# Altium project SAMC21N_Xplained_Pro.PrjPCB (part 1 of 3)
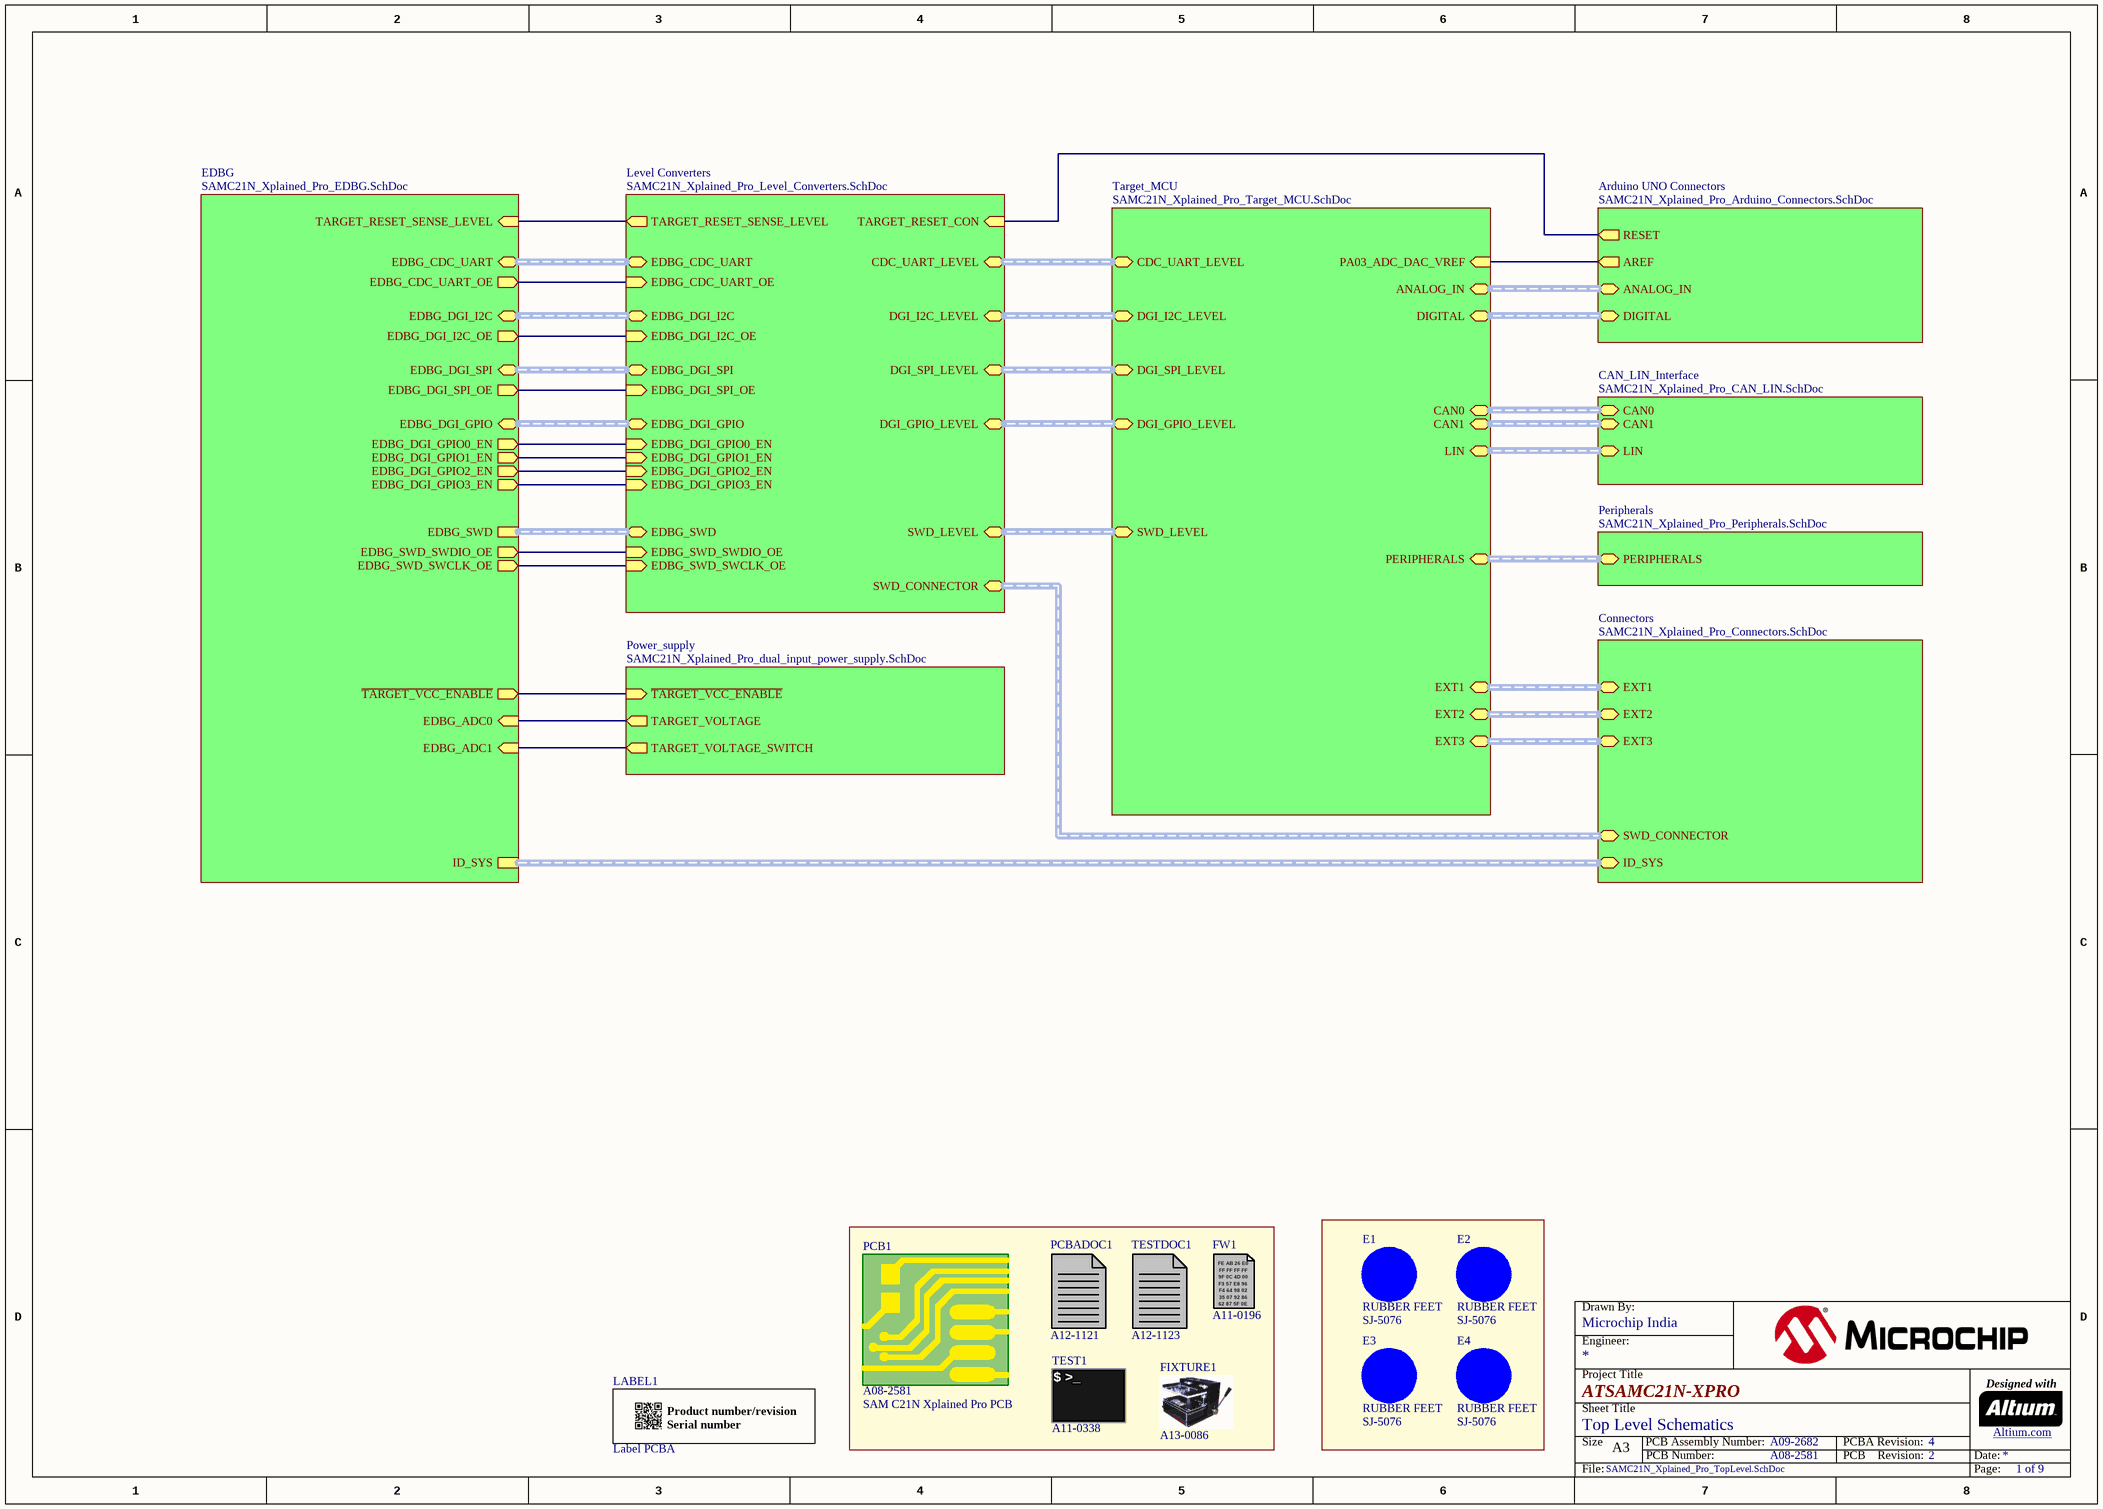
[diagram p0: SAMC21N_Xplained_Pro_TopLevel.SchDoc]
9 sheets, 256 parts. Net scope: hierarchical (ports join the sheet entries above them; power ports are global).
Board file: SAMC21N_Xplained_Pro.PcbDoc
Sheets:
  SAMC21N_Xplained_Pro_TopLevel.SchDoc
    Target_MCU = SAMC21N_Xplained_Pro_Target_MCU.SchDoc
    EDBG = SAMC21N_Xplained_Pro_EDBG.SchDoc
    Connectors = SAMC21N_Xplained_Pro_Connectors.SchDoc
    Power_supply = SAMC21N_Xplained_Pro_dual_input_power_supply.SchDoc
    CAN_LIN_Interface = SAMC21N_Xplained_Pro_CAN_LIN.SchDoc
    Arduino UNO Connectors = SAMC21N_Xplained_Pro_Arduino_Connectors.SchDoc
    Level Converters = SAMC21N_Xplained_Pro_Level_Converters.SchDoc
    Peripherals = SAMC21N_Xplained_Pro_Peripherals.SchDoc

## Sheet SAMC21N_Xplained_Pro_TopLevel.SchDoc: Top Level Schematics
size A3; Organization: Microchip India; DocumentNumber: A09-2682; Revision: 4; SheetNumber: 1; SheetTotal: 9; CheckedBy: M.S.K; DrawnBy: Microchip India; PageSetup: Record=PageOptions|CenterHorizontal=True|CenterVertical=True|PrintScale=1.01|XCorrection=1.00|YCorrection=1.00|PrintKind=1|BorderSize=5000000|LeftOffset=0|BottomOffset=0|Orientation=2|PaperLength=1000|PaperWidth=1000|Scale=100|PaperSource=7|PrintQuality=-4|MediaType=1|DitherType=10|PaperKind=Letter|PrintScaleMode=1; ProjectTitle: ATSAMC21N-XPRO; PCBNumber: A08-2581; PCBRevision: 2

### Parts
E1  RUBBER FEET  value SJ-5076  [AP8-00192]
E2  RUBBER FEET  value SJ-5076  [AP8-00192]
E3  RUBBER FEET  value SJ-5076  [AP8-00192]
E4  RUBBER FEET  value SJ-5076  [AP8-00192]
FIXTURE1  AN: A13-0086  (hidden comment: JIG)  (mechanical)
FW1  AN: A11-0196  (hidden comment: FW)  (mechanical)
LABEL1  value Label PCBA  [AP8-00317]  (hidden comment: PCBA_LABEL)
PCB1  value SAM C21N Xplained Pro PCB  AN: A08-2581  (hidden comment: PCB)  (mechanical)
PCBADOC1  AN: A12-1121  (hidden comment: PCBADOC)  (mechanical)
TEST1  AN: A11-0338  (hidden comment: TEST)  (mechanical)
TESTDOC1  AN: A12-1123  (hidden comment: TESTDOC)  (mechanical)

### Sub-sheets
Arduino UNO Connectors = SAMC21N_Xplained_Pro_Arduino_Connectors.SchDoc: ANALOG_IN (harness ANALOG_IN), DIGITAL (harness DIGITAL1), RESET (out), AREF (out)
CAN_LIN_Interface = SAMC21N_Xplained_Pro_CAN_LIN.SchDoc: CAN1 (harness CAN), LIN (harness LIN), CAN0 (harness CAN)
Connectors = SAMC21N_Xplained_Pro_Connectors.SchDoc: ID_SYS (harness ID_SYS), EXT1 (harness EXT), EXT3 (harness EXT), EXT2 (harness EXT), SWD_CONNECTOR (harness SWD)
EDBG = SAMC21N_Xplained_Pro_EDBG.SchDoc: ID_SYS (harness ID_SYS), EDBG_SWD (harness SWD), EDBG_CDC_UART (harness CDC_UART), EDBG_DGI_I2C (harness DGI_I2C), EDBG_DGI_SPI (harness DGI_SPI), EDBG_DGI_GPIO (harness DGI_GPIO), EDBG_ADC0 (in), ~{TARGET_VCC_ENABLE} (out), EDBG_CDC_UART_OE (out), EDBG_SWD_SWDIO_OE (out), EDBG_DGI_I2C_OE (out), EDBG_ADC1 (in), EDBG_SWD_SWCLK_OE (out), EDBG_DGI_SPI_OE (out), TARGET_RESET_SENSE_LEVEL (in), EDBG_DGI_GPIO0_EN (out), EDBG_DGI_GPIO1_EN (out), EDBG_DGI_GPIO2_EN (out), EDBG_DGI_GPIO3_EN (out)
Level Converters = SAMC21N_Xplained_Pro_Level_Converters.SchDoc: EDBG_DGI_SPI (harness DGI_SPI), EDBG_DGI_I2C (harness DGI_I2C), EDBG_DGI_GPIO (harness DGI_GPIO), EDBG_CDC_UART (harness CDC_UART), EDBG_SWD (harness SWD), EDBG_SWD_SWDIO_OE (in), EDBG_SWD_SWCLK_OE (in), SWD_LEVEL (harness SWD), DGI_SPI_LEVEL (harness DGI_SPI), DGI_I2C_LEVEL (harness DGI_I2C), DGI_GPIO_LEVEL (harness DGI_GPIO), CDC_UART_LEVEL (harness CDC_UART), TARGET_RESET_SENSE_LEVEL (out), SWD_CONNECTOR (harness SWD), EDBG_DGI_GPIO0_EN (in), EDBG_DGI_GPIO1_EN (in), EDBG_DGI_GPIO2_EN (in), EDBG_DGI_GPIO3_EN (in), EDBG_CDC_UART_OE (in), EDBG_DGI_I2C_OE (in), EDBG_DGI_SPI_OE (in), TARGET_RESET_CON (in)
Peripherals = SAMC21N_Xplained_Pro_Peripherals.SchDoc: PERIPHERALS (harness Peripherals)
Power_supply = SAMC21N_Xplained_Pro_dual_input_power_supply.SchDoc: TARGET_VOLTAGE (out), ~{TARGET_VCC_ENABLE} (in), TARGET_VOLTAGE_SWITCH (out)
Target_MCU = SAMC21N_Xplained_Pro_Target_MCU.SchDoc: SWD_LEVEL (harness SWD), DGI_SPI_LEVEL (harness DGI_SPI), DGI_I2C_LEVEL (harness DGI_I2C), DGI_GPIO_LEVEL (harness DGI_GPIO), CDC_UART_LEVEL (harness CDC_UART), EXT2 (harness EXT), EXT3 (harness EXT), EXT1 (harness EXT), CAN1 (harness CAN), LIN (harness LIN), DIGITAL (harness DIGITAL1), ANALOG_IN (harness ANALOG_IN), PA03_ADC_DAC_VREF (in), PERIPHERALS (harness Peripherals), CAN0 (harness CAN)

### Nets
EDBG_ADC0: sheet EDBG/EDBG_ADC0, sheet Power_supply/TARGET_VOLTAGE
EDBG_ADC1: sheet EDBG/EDBG_ADC1, sheet Power_supply/TARGET_VOLTAGE_SWITCH
EDBG_CDC_UART_OE: sheet EDBG/EDBG_CDC_UART_OE, sheet Level Converters/EDBG_CDC_UART_OE
EDBG_DGI_GPIO0_EN: sheet EDBG/EDBG_DGI_GPIO0_EN, sheet Level Converters/EDBG_DGI_GPIO0_EN
EDBG_DGI_GPIO1_EN: sheet EDBG/EDBG_DGI_GPIO1_EN, sheet Level Converters/EDBG_DGI_GPIO1_EN
EDBG_DGI_GPIO2_EN: sheet EDBG/EDBG_DGI_GPIO2_EN, sheet Level Converters/EDBG_DGI_GPIO2_EN
EDBG_DGI_GPIO3_EN: sheet EDBG/EDBG_DGI_GPIO3_EN, sheet Level Converters/EDBG_DGI_GPIO3_EN
EDBG_DGI_I2C_OE: sheet EDBG/EDBG_DGI_I2C_OE, sheet Level Converters/EDBG_DGI_I2C_OE
EDBG_DGI_SPI_OE: sheet EDBG/EDBG_DGI_SPI_OE, sheet Level Converters/EDBG_DGI_SPI_OE
EDBG_SWD_SWCLK_OE: sheet EDBG/EDBG_SWD_SWCLK_OE, sheet Level Converters/EDBG_SWD_SWCLK_OE
EDBG_SWD_SWDIO_OE: sheet EDBG/EDBG_SWD_SWDIO_OE, sheet Level Converters/EDBG_SWD_SWDIO_OE
PA03_ADC_DAC_VREF: sheet Target_MCU/PA03_ADC_DAC_VREF, sheet Arduino UNO Connectors/AREF
~{TARGET_VCC_ENABLE}: sheet EDBG/~{TARGET_VCC_ENABLE}, sheet Power_supply/~{TARGET_VCC_ENABLE}
TARGET_RESET_CON: sheet Arduino UNO Connectors/RESET, sheet Level Converters/TARGET_RESET_CON
TARGET_RESET_SENSE_LEVEL: sheet EDBG/TARGET_RESET_SENSE_LEVEL, sheet Level Converters/TARGET_RESET_SENSE_LEVEL

Not connected (* = marked no-connect by the designer): E1 1(FIDUCIAL); E2 1(FIDUCIAL); E3 1(FIDUCIAL); E4 1(FIDUCIAL)

### Buses and harness runs
harness sheet Arduino UNO Connectors/ANALOG_IN = sheet Target_MCU/ANALOG_IN
harness sheet Arduino UNO Connectors/DIGITAL = sheet Target_MCU/DIGITAL
harness sheet CAN_LIN_Interface/CAN0 = sheet Target_MCU/CAN0
harness sheet CAN_LIN_Interface/CAN1 = sheet Target_MCU/CAN1
harness sheet CAN_LIN_Interface/LIN = sheet Target_MCU/LIN
harness sheet Connectors/EXT1 = sheet Target_MCU/EXT1
harness sheet Connectors/EXT2 = sheet Target_MCU/EXT2
harness sheet Connectors/EXT3 = sheet Target_MCU/EXT3
harness sheet Connectors/ID_SYS = sheet EDBG/ID_SYS
harness sheet Connectors/SWD_CONNECTOR = sheet Level Converters/SWD_CONNECTOR
harness sheet EDBG/EDBG_CDC_UART = sheet Level Converters/EDBG_CDC_UART
harness sheet EDBG/EDBG_DGI_GPIO = sheet Level Converters/EDBG_DGI_GPIO
harness sheet EDBG/EDBG_DGI_I2C = sheet Level Converters/EDBG_DGI_I2C
harness sheet EDBG/EDBG_DGI_SPI = sheet Level Converters/EDBG_DGI_SPI
harness sheet EDBG/EDBG_SWD = sheet Level Converters/EDBG_SWD
harness sheet Level Converters/CDC_UART_LEVEL = sheet Target_MCU/CDC_UART_LEVEL
harness sheet Level Converters/DGI_GPIO_LEVEL = sheet Target_MCU/DGI_GPIO_LEVEL
harness sheet Level Converters/DGI_I2C_LEVEL = sheet Target_MCU/DGI_I2C_LEVEL
harness sheet Level Converters/DGI_SPI_LEVEL = sheet Target_MCU/DGI_SPI_LEVEL
harness sheet Level Converters/SWD_LEVEL = sheet Target_MCU/SWD_LEVEL
harness sheet Peripherals/PERIPHERALS = sheet Target_MCU/PERIPHERALS

### Notes on the sheet
- Drawn By:
- Project Title
- Engineer:
- Designed with
- Sheet Title
- Size
- A3
- PCB Number:
- PCB Assembly Number:
- PCBA Revision:
- PCB    Revision:
- Date:
- Altium.com <http://go.altium.com/MicrochipLandingPage_Evaluation.html>
- File:
- Page:
- (in symbol A09-0611) / Product number/revision / Serial number
- (in symbol A11-0196) FE AB 26 E0; FF FF FF FF; 9F 0C 4D 00; F3 57 E8 96; F4 64 98 02; 35 07 92 86; 62 87 5F 0E
- (in symbol A11-0338) $ >_

### Library data of the parts
E1-E4 = A08-0053: 2.8mm adhesive feet,diam 8.0mm; PartGroup: Mechanical devices,Mounting accessories; Manufacturer: 3M; ComponentStatus: 'Active (verified)'; Verified date: 2006-05-05; Verified by: Ketil Skjerve; Status: Active; AN: A08-0053; Height: 2,79999995231628; MPN: SJ-5076; FootprintStatus: 'Active (Verified)'
FIXTURE1 = A13-0086: Xplained PRO MCU board Jupiter Test Fixture; PartGroup: Test Equipment,Test Fixtures; Manufacturer: ESCATEC; ComponentStatus: 'Active (verified)'; Value: Xplained PRO MCU board Jupiter Test Fixture; MPN: Xplained PRO MCU board Jupiter Test Fixture
FW1 = A11-0196: EDBG secured firmware; PartGroup: Software,Firmware,Tools; Manufacturer: ATMEL; ComponentStatus: 'Active (verified)'; Value: EDBG secured firmware
LABEL1 = A09-0611: PCBA identification label PP Top White Gloss; PartGroup: Mechanical devices,Packaging materials,Printed Labels; Manufacturer: ACT Logimark AS; MPN: 505462; ComponentStatus: 'Active (verified)'; Status: New; AN: A09-0611; FootprintStatus: 'Active (Verified)'
PCB1 = A08-2581: SAM C21N Xplained Pro PCB, 4 layer, 60mm x 100mm; PartGroup: Mechanical devices,Printed circuit boards; ComponentStatus: 'New (not verified)'
PCBADOC1 = A12-1121: SAM C21N Xplained Pro PCBA documentation; PartGroup: Documentation,PCBA Documents,Atmel; Value: A09-2682 PCBA Files; ComponentStatus: 'New (not verified)'
TEST1 = A11-0338: Fixture eggTest for SAM C21N Xplained Pro; PartGroup: Software,Test software,Starter Kit; Value: SAM C21N Xplained Pro test; ComponentStatus: 'New (not verified)'
TESTDOC1 = A12-1123: SAM C21N Xplained Pro Test Instructions; PartGroup: Documentation,Procedures,Test Instructions; ComponentStatus: 'New (not verified)'; Value: SAM C21N Xplained Pro Test Instructions

## Sheet SAMC21N_Xplained_Pro_Target_MCU.SchDoc: Target MCU
size A3; Organization: Microchip India; DocumentNumber: A09-2682; Revision: 4; SheetNumber: 4; SheetTotal: 9; CheckedBy: M.S.K; DrawnBy: Microchip India; PageSetup: Record=PageOptions|CenterHorizontal=True|CenterVertical=True|PrintScale=1.04|XCorrection=1.00|YCorrection=1.00|PrintKind=0|BorderSize=5000000|LeftOffset=0|BottomOffset=0|Orientation=2|PaperLength=4200|PaperWidth=2970|Scale=100|PaperSource=15|PrintQuality=600|MediaType=1|DitherType=10|PrintScaleMode=1|PaperKind=A3|PaperIndex=8; ProjectTitle: ATSAMC21N-XPRO; PCBNumber: A08-2581; PCBRevision: 2
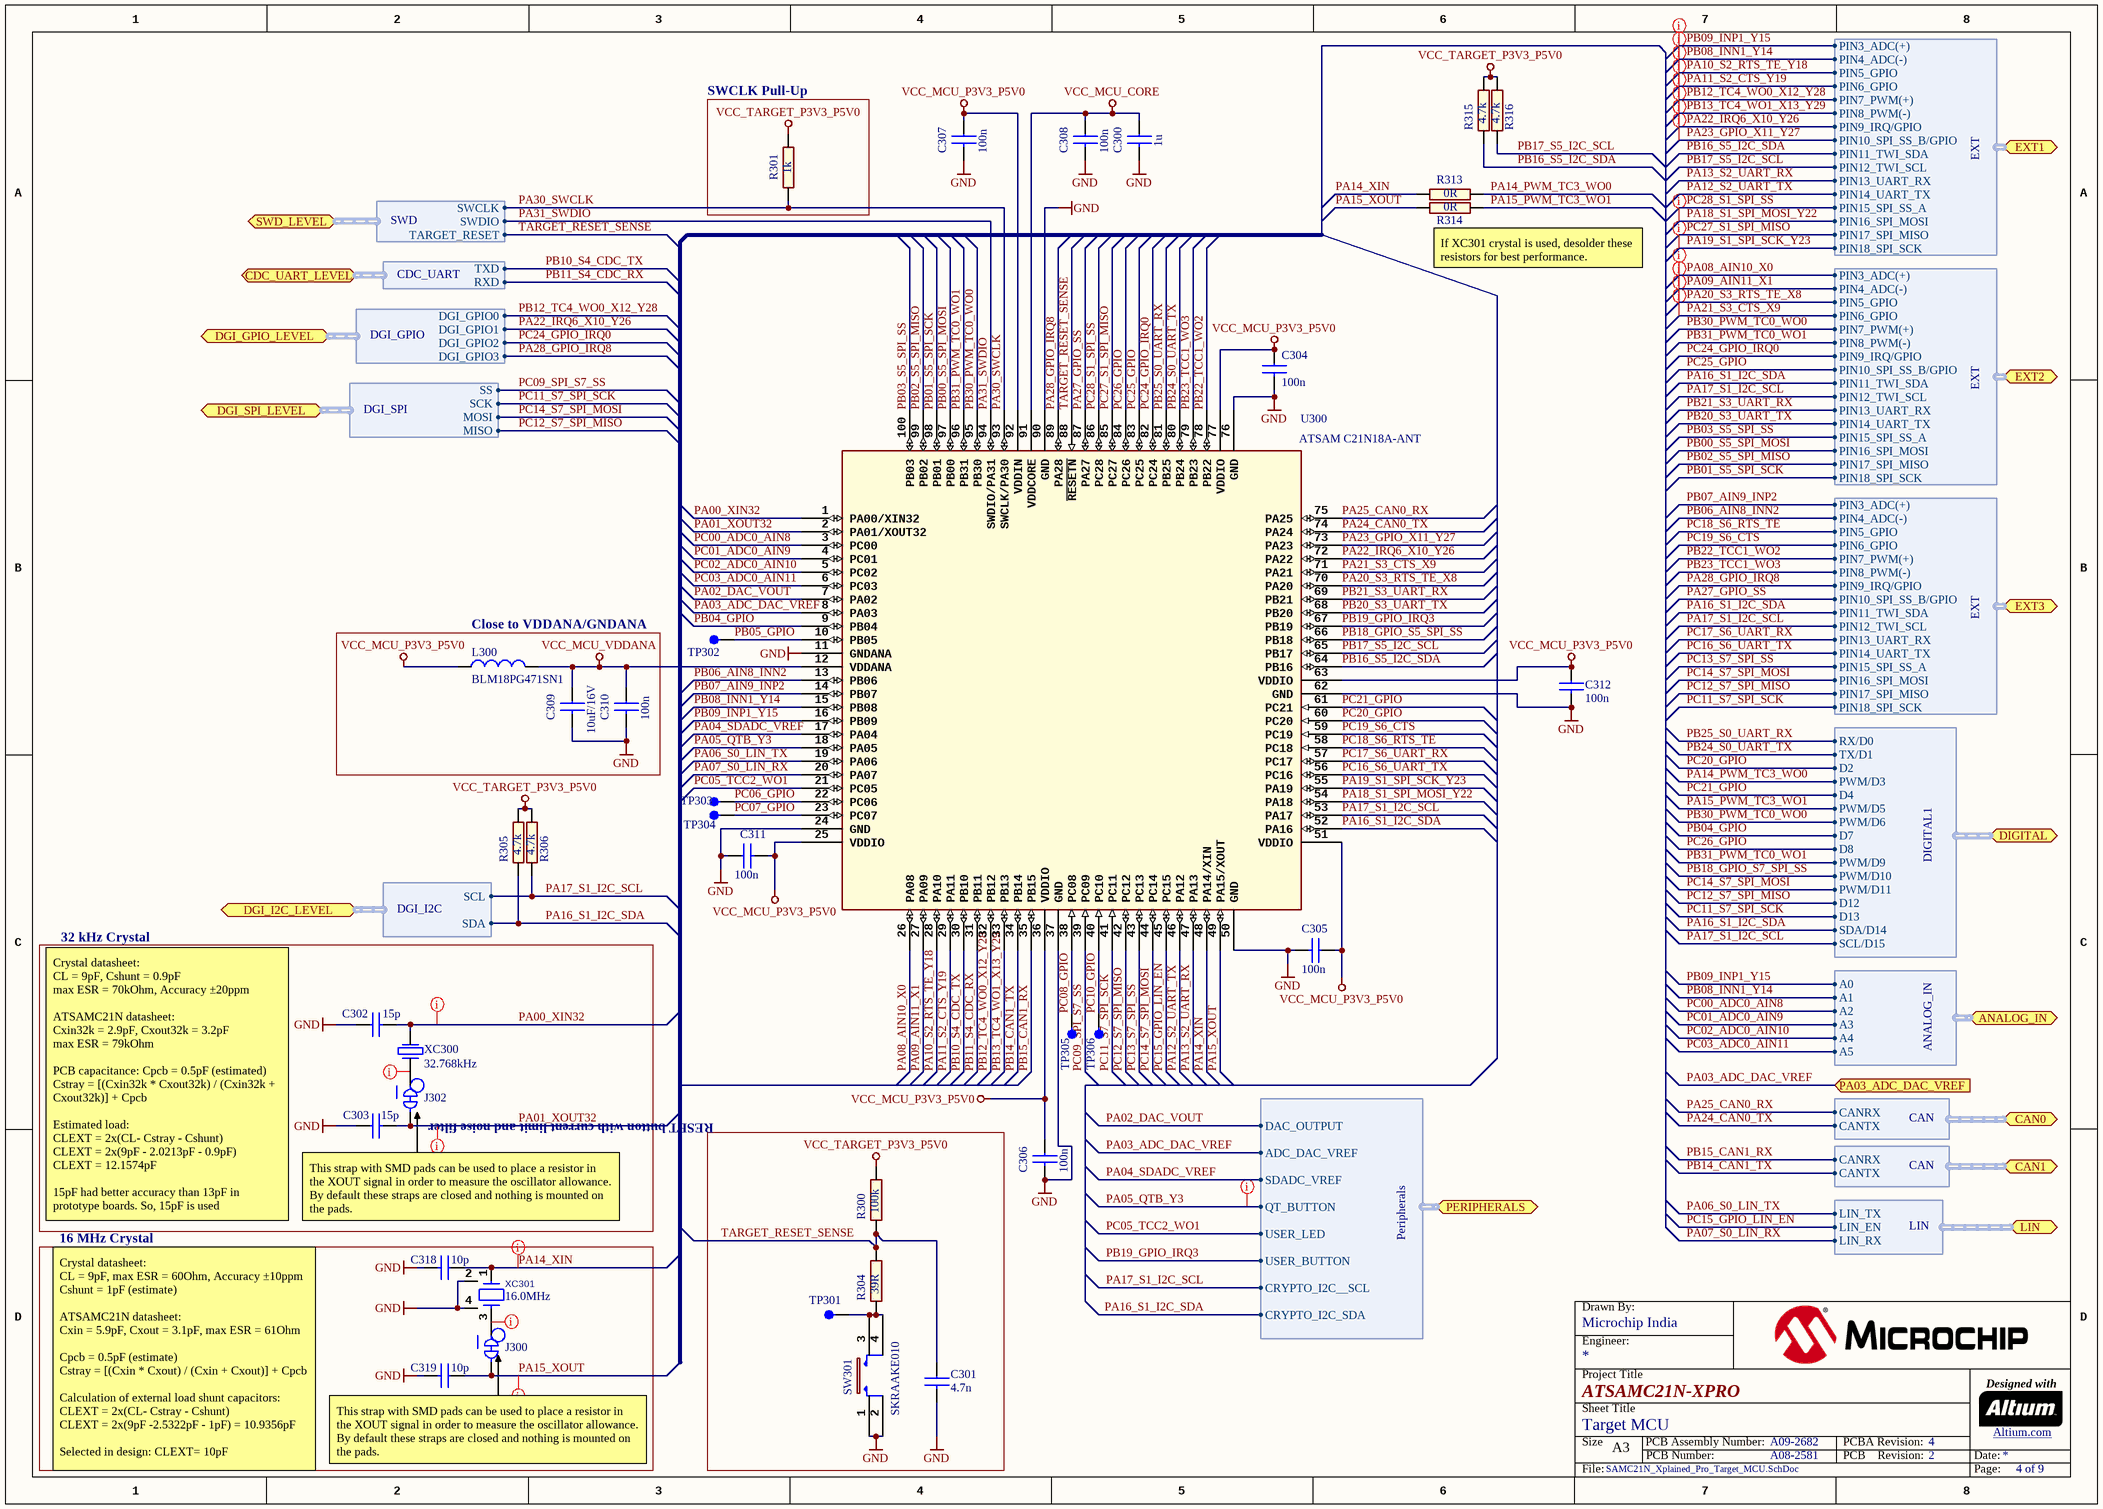
[diagram p1: SAMC21N_Xplained_Pro_Target_MCU.SchDoc]

### Parts
C300  value 1u  [AP1-00001]  (hidden comment: CAP-NONPOL)
C301  value 4.7n  [AP1-00001]  (hidden comment: CAP-NONPOL)
C302  value 15p  [AP1-00001]  (hidden comment: CAP-NONPOL)
C303  value 15p  [AP1-00001]  (hidden comment: CAP-NONPOL)
C304  value 100n  [AP1-00001]  (hidden comment: CAP-NONPOL)
C305  value 100n  [AP1-00001]  (hidden comment: CAP-NONPOL)
C306  value 100n  [AP1-00001]  (hidden comment: CAP-NONPOL)
C307  value 100n  [AP1-00001]  (hidden comment: CAP-NONPOL)
C308  value 100n  [AP1-00001]  (hidden comment: CAP-NONPOL)
C309  value 10uF/16V  [AP1-00039]  (hidden comment: CAP-NONPOL)
C310  value 100n  [AP1-00001]  (hidden comment: CAP-NONPOL)
C311  value 100n  [AP1-00001]  (hidden comment: CAP-NONPOL)
C312  value 100n  [AP1-00001]  (hidden comment: CAP-NONPOL)
C318  value 10p  [AP1-00001]  (hidden comment: CAP-NONPOL)
C319  value 10p  [AP1-00001]  (hidden comment: CAP-NONPOL)
J300  (no value)  [AP9-00044]  (net tie, no BOM)
J302  (no value)  [AP9-00044]  (net tie, no BOM)
L300  BLM18PG471SN1  [AP3-00005]
R300  value 100k  [AP2-00011]  (hidden comment: R2)
R301  value 1k  [AP2-00000]  (hidden comment: R2)
R304  value 39R  [AP2-00011]  (hidden comment: R2)
R305  value 4.7k  [AP2-00000]  (hidden comment: R2)
R306  value 4.7k  [AP2-00000]  (hidden comment: R2)
R313  value 0R  [AP2-00000]  (hidden comment: R2)
R314  value 0R  [AP2-00000]  (hidden comment: R2)
R315  value 4.7k  [AP2-00000]  (hidden comment: R2)
R316  value 4.7k  [AP2-00000]  (hidden comment: R2)
SW301  value SKRAAKE010  [AP8-00137]  (hidden comment: Can be ordered in low volumes from Mouser)
TP301  TESTPOINT  [AP8-00010]  (value not drawn)  (no BOM)
TP302  TESTPOINT  [AP8-00256]  (value not drawn)  (no BOM)
TP303  TESTPOINT  [AP8-00256]  (value not drawn)  (no BOM)
TP304  TESTPOINT  [AP8-00256]  (value not drawn)  (no BOM)
TP305  TESTPOINT  [AP8-00256]  (value not drawn)  (no BOM)
TP306  TESTPOINT  [AP8-00256]  (value not drawn)  (no BOM)
U300  value ATSAM C21N18A-ANT  [AP6-00008]  (hidden comment: SAMC21N_TQFP100)
XC300  value 32.768kHz  [AP7-00090]  (hidden comment: CRYSTAL)
XC301  value 16.0MHz  [AP7-00061]  (hidden comment: TSX-3225)

### Blocks framed on the sheet
SWCLK Pull-Up: R301
Close to VDDANA/GNDANA: C309 C310 L300
32 kHz Crystal: C302 C303 J302 XC300
RESET button with current limit and noise filter: C301 R300 R304 SW301 TP301
16 MHz Crystal: C318 C319 J300 XC301

### Ports
ANALOG_IN (harness ANALOG_IN), CAN0 (harness CAN), CAN1 (harness CAN), CDC_UART_LEVEL (harness CDC_UART), DGI_GPIO_LEVEL (harness DGI_GPIO), DGI_I2C_LEVEL (harness DGI_I2C), DGI_SPI_LEVEL (harness DGI_SPI), DIGITAL (harness DIGITAL1), EXT1 (harness EXT), EXT2 (harness EXT), EXT3 (harness EXT), LIN (harness LIN), PA03_ADC_DAC_VREF (in), PERIPHERALS (harness Peripherals), SWD_LEVEL (harness SWD)

### Harnesses
SWD: SWCLK, SWDIO, TARGET_RESET
DGI_GPIO: DGI_GPIO0, DGI_GPIO1, DGI_GPIO2, DGI_GPIO3
DGI_SPI: MISO, MOSI, SCK, SS
DGI_I2C: SCL, SDA
CDC_UART: RXD, TXD
EXT: PIN10_SPI_SS_B/GPIO, PIN11_TWI_SDA, PIN12_TWI_SCL, PIN13_UART_RX, PIN14_UART_TX, PIN15_SPI_SS_A, PIN16_SPI_MOSI, PIN17_SPI_MISO, PIN18_SPI_SCK, PIN3_ADC(+), PIN4_ADC(-), PIN5_GPIO, PIN6_GPIO, PIN7_PWM(+), PIN8_PWM(-), PIN9_IRQ/GPIO
DIGITAL1: RX/D0, TX/D1, D2, PWM/D3, D4, PWM/D5, PWM/D6, D7, D8, PWM/D9, PWM/D10, PWM/D11, D12, D13, SDA/D14, SCL/D15
ANALOG_IN: A0, A1, A2, A3, A4, A5
CAN: CANTX, CANRX
LIN: LIN_RX, LIN_EN, LIN_TX
Peripherals: DAC_OUTPUT, ADC_DAC_VREF, SDADC_VREF, QT_BUTTON, USER_LED, USER_BUTTON, CRYPTO_I2C__SCL, CRYPTO_I2C_SDA

### Nets
GND: C300.2 C301.2 C302.1 C303.1 C304.2 C305.2 C306.2 C307.2 C308.2 C309.2 C310.2 C311.1 C312.2 C318.2 C319.2 SW301.1 SW301.2 U300.11(GNDANA) U300.24(GND) U300.37(GND) U300.50(GND) U300.62(GND) U300.76(GND) U300.90(GND) XC301.2(GND) XC301.4(GND)
VCC_MCU_CORE: C300.1 C308.1 U300.91(VDDCORE)
VCC_MCU_P3V3_P5V0: C304.1 C305.1 C306.1 C307.1 C311.2 C312.1 L300.1 U300.25(VDDIO) U300.36(VDDIO) U300.51(VDDIO) U300.63(VDDIO) U300.77(VDDIO) U300.92(VDDIN)
VCC_MCU_VDDANA: C309.1 C310.1 L300.2 U300.12(VDDANA)
VCC_TARGET_P3V3_P5V0: R300.2 R301.2 R305.2 R306.2 R315.2 R316.2
PA00_XIN32: C302.2 U300.1(PA00/XIN32) XC300.1
PA01_XOUT32: C303.2 J302.2 U300.2(PA01/XOUT32)
PA02_DAC_VOUT: U300.7(PA02) ; port PERIPHERALS.DAC_OUTPUT
PA03_ADC_DAC_VREF: U300.8(PA03) ; port PA03_ADC_DAC_VREF, port PERIPHERALS.ADC_DAC_VREF
PA04_SDADC_VREF: U300.17(PA04) ; port PERIPHERALS.SDADC_VREF
PA05_QTB_Y3: U300.18(PA05) ; port PERIPHERALS.QT_BUTTON
PA06_S0_LIN_TX: U300.19(PA06) ; port LIN.LIN_TX
PA07_S0_LIN_RX: U300.20(PA07) ; port LIN.LIN_RX
PA08_AIN10_X0: U300.26(PA08) ; port EXT2.PIN3_ADC(+)
PA09_AIN11_X1: U300.27(PA09) ; port EXT2.PIN4_ADC(-)
PA10_S2_RTS_TE_Y18: U300.28(PA10) ; port EXT1.PIN5_GPIO
PA11_S2_CTS_Y19: U300.29(PA11) ; port EXT1.PIN6_GPIO
PA12_S2_UART_TX: U300.46(PA12) ; port EXT1.PIN14_UART_TX
PA13_S2_UART_RX: U300.47(PA13) ; port EXT1.PIN13_UART_RX
PA14_PWM_TC3_WO0: R313.2 ; port DIGITAL.PWM/D3
PA14_XIN: C318.1 R313.1 U300.48(PA14/XIN) XC301.1(IN)
PA15_PWM_TC3_WO1: R314.2 ; port DIGITAL.PWM/D5
PA15_XOUT: C319.1 J300.2 R314.1 U300.49(PA15/XOUT)
PA16_S1_I2C_SDA: R305.1 U300.52(PA16) ; port DGI_I2C_LEVEL.SDA, port EXT2.PIN11_TWI_SDA, port EXT3.PIN11_TWI_SDA, port DIGITAL.SDA/D14, port PERIPHERALS.CRYPTO_I2C_SDA
PA17_S1_I2C_SCL: R306.1 U300.53(PA17) ; port DGI_I2C_LEVEL.SCL, port EXT2.PIN12_TWI_SCL, port EXT3.PIN12_TWI_SCL, port DIGITAL.SCL/D15, port PERIPHERALS.CRYPTO_I2C__SCL
PA18_S1_SPI_MOSI_Y22: U300.54(PA18) ; port EXT1.PIN16_SPI_MOSI
PA19_S1_SPI_SCK_Y23: U300.55(PA19) ; port EXT1.PIN18_SPI_SCK
PA20_S3_RTS_TE_X8: U300.70(PA20) ; port EXT2.PIN5_GPIO
PA21_S3_CTS_X9: U300.71(PA21) ; port EXT2.PIN6_GPIO
PA22_IRQ6_X10_Y26: U300.72(PA22) ; port DGI_GPIO_LEVEL.DGI_GPIO1, port EXT1.PIN9_IRQ/GPIO
PA23_GPIO_X11_Y27: U300.73(PA23) ; port EXT1.PIN10_SPI_SS_B/GPIO
PA24_CAN0_TX: U300.74(PA24) ; port CAN0.CANTX
PA25_CAN0_RX: U300.75(PA25) ; port CAN0.CANRX
PA27_GPIO_SS: U300.87(PA27) ; port EXT3.PIN10_SPI_SS_B/GPIO
PA28_GPIO_IRQ8: U300.89(PA28) ; port DGI_GPIO_LEVEL.DGI_GPIO3, port EXT3.PIN9_IRQ/GPIO
PA30_SWCLK: R301.1 U300.93(SWCLK/PA30) ; port SWD_LEVEL.SWCLK
PA31_SWDIO: U300.94(SWDIO/PA31) ; port SWD_LEVEL.SWDIO
PB00_S5_SPI_MOSI: U300.97(PB00) ; port EXT2.PIN16_SPI_MOSI
PB01_S5_SPI_SCK: U300.98(PB01) ; port EXT2.PIN18_SPI_SCK
PB02_S5_SPI_MISO: U300.99(PB02) ; port EXT2.PIN17_SPI_MISO
PB03_S5_SPI_SS: U300.100(PB03) ; port EXT2.PIN15_SPI_SS_A
PB04_GPIO: U300.9(PB04) ; port DIGITAL.D7
PB05_GPIO: TP302.1 U300.10(PB05)
PB06_AIN8_INN2: U300.13(PB06) ; port EXT3.PIN4_ADC(-)
PB07_AIN9_INP2: U300.14(PB07) ; port EXT3.PIN3_ADC(+)
PB08_INN1_Y14: U300.15(PB08) ; port EXT1.PIN4_ADC(-), port ANALOG_IN.A1
PB09_INP1_Y15: U300.16(PB09) ; port EXT1.PIN3_ADC(+), port ANALOG_IN.A0
PB10_S4_CDC_TX: U300.30(PB10) ; port CDC_UART_LEVEL.TXD
PB11_S4_CDC_RX: U300.31(PB11) ; port CDC_UART_LEVEL.RXD
PB12_TC4_WO0_X12_Y28: U300.32(PB12) ; port DGI_GPIO_LEVEL.DGI_GPIO0, port EXT1.PIN7_PWM(+)
PB13_TC4_WO1_X13_Y29: U300.33(PB13) ; port EXT1.PIN8_PWM(-)
PB14_CAN1_TX: U300.34(PB14) ; port CAN1.CANTX
PB15_CAN1_RX: U300.35(PB15) ; port CAN1.CANRX
PB16_S5_I2C_SDA: R315.1 U300.64(PB16) ; port EXT1.PIN11_TWI_SDA
PB17_S5_I2C_SCL: R316.1 U300.65(PB17) ; port EXT1.PIN12_TWI_SCL
PB18_GPIO_S5_SPI_SS: U300.66(PB18)
PB19_GPIO_IRQ3: U300.67(PB19) ; port PERIPHERALS.USER_BUTTON
PB20_S3_UART_TX: U300.68(PB20) ; port EXT2.PIN14_UART_TX
PB21_S3_UART_RX: U300.69(PB21) ; port EXT2.PIN13_UART_RX
PB22_TCC1_WO2: U300.78(PB22) ; port EXT3.PIN7_PWM(+)
PB23_TCC1_WO3: U300.79(PB23) ; port EXT3.PIN8_PWM(-)
PB24_S0_UART_TX: U300.80(PB24) ; port DIGITAL.TX/D1
PB25_S0_UART_RX: U300.81(PB25) ; port DIGITAL.RX/D0
PB30_PWM_TC0_WO0: U300.95(PB30) ; port EXT2.PIN7_PWM(+), port DIGITAL.PWM/D6
PB31_PWM_TC0_WO1: U300.96(PB31) ; port EXT2.PIN8_PWM(-), port DIGITAL.PWM/D9
PC00_ADC0_AIN8: U300.3(PC00) ; port ANALOG_IN.A2
PC01_ADC0_AIN9: U300.4(PC01) ; port ANALOG_IN.A3
PC02_ADC0_AIN10: U300.5(PC02) ; port ANALOG_IN.A4
PC03_ADC0_AIN11: U300.6(PC03) ; port ANALOG_IN.A5
PC05_TCC2_WO1: U300.21(PC05) ; port PERIPHERALS.USER_LED
PC06_GPIO: TP303.1 U300.22(PC06)
PC07_GPIO: TP304.1 U300.23(PC07)
PC08_GPIO: TP305.1 U300.38(PC08)
PC09_SPI_S7_SS: U300.39(PC09) ; port DGI_SPI_LEVEL.SS
PC10_GPIO: TP306.1 U300.40(PC10)
PC11_S7_SPI_SCK: U300.41(PC11) ; port DGI_SPI_LEVEL.SCK, port EXT3.PIN18_SPI_SCK, port DIGITAL.D13
PC12_S7_SPI_MISO: U300.42(PC12) ; port DGI_SPI_LEVEL.MISO, port EXT3.PIN17_SPI_MISO, port DIGITAL.D12
PC13_S7_SPI_SS: U300.43(PC13) ; port EXT3.PIN15_SPI_SS_A
PC14_S7_SPI_MOSI: U300.44(PC14) ; port DGI_SPI_LEVEL.MOSI, port EXT3.PIN16_SPI_MOSI, port DIGITAL.PWM/D11
PC15_GPIO_LIN_EN: U300.45(PC15) ; port LIN.LIN_EN
PC16_S6_UART_TX: U300.56(PC16) ; port EXT3.PIN14_UART_TX
PC17_S6_UART_RX: U300.57(PC17) ; port EXT3.PIN13_UART_RX
PC18_S6_RTS_TE: U300.58(PC18) ; port EXT3.PIN5_GPIO
PC19_S6_CTS: U300.59(PC19) ; port EXT3.PIN6_GPIO
PC20_GPIO: U300.60(PC20) ; port DIGITAL.D2
PC21_GPIO: U300.61(PC21) ; port DIGITAL.D4
PC24_GPIO_IRQ0: U300.82(PC24) ; port DGI_GPIO_LEVEL.DGI_GPIO2, port EXT2.PIN9_IRQ/GPIO
PC25_GPIO: U300.83(PC25) ; port EXT2.PIN10_SPI_SS_B/GPIO
PC26_GPIO: U300.84(PC26) ; port DIGITAL.D8
PC27_S1_SPI_MISO: U300.85(PC27) ; port EXT1.PIN17_SPI_MISO
PC28_S1_SPI_SS: U300.86(PC28) ; port EXT1.PIN15_SPI_SS_A
TARGET_RESET_SENSE: C301.1 R300.1 R304.2 U300.88(~{RESETN}) ; port SWD_LEVEL.TARGET_RESET
NetJ300_1: J300.1 XC301.3(OUT)
NetJ302_1: J302.1 XC300.2
NetR304_1: R304.1 SW301.3 SW301.4 TP301.1

### Layout directives
rule Assembly Testpoint Usage [Testpoint - Not Allowed    Multiple - Not Allowed]: NetJ300_1, NetJ302_1, PA00_XIN32, PA01_XOUT32, PA14_XIN, PA15_XOUT
net class TOUCH; rule Clearance Constraint [Clearance = 0.6mm]: PA05_QTB_Y3, PA08_AIN10_X0, PA09_AIN11_X1, PA10_S2_RTS_TE_Y18, PA11_S2_CTS_Y19, PA18_S1_SPI_MOSI_Y22, PA19_S1_SPI_SCK_Y23, PA20_S3_RTS_TE_X8, PA21_S3_CTS_X9, PA22_IRQ6_X10_Y26, PA23_GPIO_X11_Y27, PB08_INN1_Y14, PB09_INP1_Y15, PB12_TC4_WO0_X12_Y28, PB13_TC4_WO1_X13_Y29

### Notes on the sheet
- If XC301 crystal is used, desolder these resistors for best performance.
- Crystal datasheet:
  CL = 9pF, Cshunt = 0.9pF
  max ESR = 70kOhm, Accuracy ±20ppm
  ATSAMC21N datasheet:
  Cxin32k = 2.9pF, Cxout32k = 3.2pF
  max ESR = 79kOhm
  PCB capacitance: Cpcb = 0.5pF (estimated)
  Cstray = [(Cxin32k * Cxout32k) / (Cxin32k + Cxout32k)] + Cpcb
  Estimated load:
  CLEXT = 2x(CL- Cstray - Cshunt)
  CLEXT = 2x(9pF - 2.0213pF - 0.9pF)
  CLEXT = 12.1574pF
  15pF had better accuracy than 13pF in prototype boards. So, 15pF is used
- This strap with SMD pads can be used to place a resistor in the XOUT signal in order to measure the oscillator allowance.
  By default these straps are closed and nothing is mounted on the pads.
- Crystal datasheet:
  CL = 9pF, max ESR = 60Ohm, Accuracy ±10ppm
  Cshunt = 1pF (estimate)
  ATSAMC21N datasheet:
  Cxin = 5.9pF, Cxout = 3.1pF, max ESR = 61Ohm
  Cpcb = 0.5pF (estimate)
  Cstray = [(Cxin * Cxout) / (Cxin + Cxout)] + Cpcb
  Calculation of external load shunt capacitors:
  CLEXT = 2x(CL- Cstray - Cshunt)
  CLEXT = 2x(9pF -2.5322pF - 1pF) = 10.9356pF
  Selected in design: CLEXT= 10pF
- Drawn By:
- Project Title
- Engineer:
- Designed with
- Sheet Title
- Size
- A3
- PCB Number:
- PCB Assembly Number:
- PCBA Revision:
- PCB    Revision:
- Date:
- Altium.com <http://go.altium.com/MicrochipLandingPage_Evaluation.html>
- File:
- Page:

### Library data of the parts
C300 = A01-0286: Ceramic capacitor, SMD 0402, X5R, 6.3V, +/-10% (de26942); PartGroup: Capacitors,Ceramic,SMD 0402; Manufacturer: Kemet; MPN: C0402C105K9PAC; TemperatureRange: -55 to 85 deg C; ComponentStatus: 'Active (verified)'; Status: Active; Verified by: Lars Helge Mo; Verified date: 2005-12-15; AN: A01-0286; Tolerance: +/-10%; Height: 0,5; FootprintStatus: 'Active (Verified)'
C301 = A01-0046: Ceramic capacitor, SMD 0402, X7R, 25V, +/-10% (de35287); PartGroup: Capacitors,Ceramic,SMD 0402; TemperatureRange: -55 - +125 deg C; ComponentStatus: 'Active (verified)'; Status: Active; Verified by: Lars Helge Mo; Verified date: 2005-12-15; AN: A01-0046; Tolerance: 25V, +/-10%; Height: 0.550000011920929; FootprintStatus: 'Active (Verified)'
C302 C303 = A01-0017: Ceramic capacitor, SMD 0402, NP0, 50V, +/-5%; PartGroup: Capacitors,Ceramic,SMD 0402; Manufacturer: AVX; MPN: 04025A150JAT2A; TemperatureRange: -55 - +125 deg C; ComponentStatus: 'Active (verified)'; Status: Active; Verified by: Lars Helge Mo; Verified date: 2005-12-15; AN: A01-0017; Tolerance: 50V, +/-5%; Height: 0.550000011920929; FootprintStatus: 'Active (Verified)'
C304-C308 C310-C312 = A01-0246: Ceramic capacitor, SMD 0402, X7R, 16V, +/-10%; PartGroup: Capacitors,Ceramic,SMD 0402; Manufacturer: Kemet; MPN: C0402C104K4RACTU; TemperatureRange: -55 - +125 deg C; ComponentStatus: 'Active (verified)'; Status: Active; Verified by: Lars Helge Mo; Verified date: 2005-12-15; AN: A01-0246; Tolerance: 16V, +/-10%; Height: 0,5; FootprintStatus: 'Active (Verified)'
C309 = A01-0491: Ceramic capacitor, SMD 0603, X5R, 16V, 10UF ± 20% (High Density); PartGroup: Capacitors,Ceramic,SMD 0603; Manufacturer: Taiyo Yuden; MPN: EMK107BBJ106MA-T; ComponentStatus: 'New (not verified)'; Status: Active; Verified by: Lars Helge Mo; Verified date: 2005-12-15; AN: A01-0491; FootprintStatus: 'Active (Verified)'
C318 C319 = A01-0015: Ceramic capacitor, SMD 0402, NP0, 50V, +/-5%; PartGroup: Capacitors,Ceramic,SMD 0402; TemperatureRange: -55 - +125 deg C; ComponentStatus: 'Active (verified)'; Status: Active; Verified by: Lars Helge Mo; Verified date: 2005-12-15; AN: A01-0015; Tolerance: 50V, +/-5%; Height: 0,550000011920929; FootprintStatus: 'Active (Verified)'
J300 J302 = A09-0783: Default closed SMD strap, 0603 size; PartGroup: Mechanical devices,PCB implemented components; Value: SMD-STRAP_0603_CLOSED; ComponentStatus: 'Active (verified)'; AN: A09-0783; Height: 0; FootprintStatus: 'Active (Verified)'
L300 = A03-0035: SMD RF inductor 0603. Z=470Ohm (@100MHz), Max R(dc)=0.65Ohm, Max current=1A; PartGroup: Inductors,EMI; Manufacturer: Murata; Tolerance: ±25%; TemperatureRange: -55°C to +125°C; ComponentStatus: 'Active (verified)'; Verified date: 2006-01-30; Verified by: Lars Helge Mo; Status: Active; AN: A03-0035; Value: BLM18PG471SN1; Height: 0,800000011920929; MPN: BLM18PG471SN1; FootprintStatus: 'Active (Verified)'
R300 = A02-0260: Thick film resistor, SMD 0402, 1/16W, 1%; PartGroup: Resistors,SMD,0402 1%; TemperatureRange: -55 - +125 deg C; ComponentStatus: 'Active (verified)'; Status: Active; Verified by: Lars Helge Mo; Verified date: 2005-12-19; AN: A02-0260; Tolerance: 1 %; Height: 0,349999994039536; FootprintStatus: 'Active (Verified)'
R301 = A02-0212: Thick film resistor, SMD 0402, 1/16W, 1%; PartGroup: Resistors,SMD,0402 1%; TemperatureRange: -55 - +125 deg C; ComponentStatus: 'Active (verified)'; Status: Active; Verified by: Lars Helge Mo; Verified date: 2005-12-19; AN: A02-0212; Tolerance: 1 %; Height: 0,349999994039536; FootprintStatus: 'Active (Verified)'
R304 = A02-0178: Thick film resistor, SMD 0402, 1/16W, 1%; PartGroup: Resistors,SMD,0402 1%; TemperatureRange: -55 - +125 deg C; ComponentStatus: 'Active (verified)'; Status: Active; Verified by: Lars Helge Mo; Verified date: 2005-12-19; AN: A02-0178; Tolerance: 1 %; Height: 0,349999994039536; FootprintStatus: 'Active (Verified)'
R305 R306 R315 R316 = A02-0228: Thick film resistor, SMD 0402, 1/16W, 1%; PartGroup: Resistors,SMD,0402 1%; TemperatureRange: -55 - +125 deg C; ComponentStatus: 'Active (verified)'; Status: Active; Verified by: Lars Helge Mo; Verified date: 2005-12-19; AN: A02-0228; Tolerance: 1 %; Height: 0.349999994039536; FootprintStatus: 'Active (Verified)'
R313 R314 = A02-0163: Thick film resistor, SMD 0402, 1/16W, 1%; PartGroup: Resistors,SMD,0402 1%; TemperatureRange: -55 - +125 deg C; ComponentStatus: 'Active (verified)'; Status: Active; Verified by: Lars Helge Mo; Verified date: 2005-12-19; AN: A02-0163; Tolerance: 1 %; Height: 0.349999994039536; FootprintStatus: 'Active (Verified)'
SW301 = A08-0790: 6.2x6.2 mm SMD tact switch, same as A08-0091 but less force is needed; PartGroup: Mechanical devices,Switches,SMD; Manufacturer: ALPS; TemperatureRange: -30 - +90 deg C; ComponentStatus: 'Active (verified)'; Status: Active; Verified by: Ketil Skjerve; Verified date: 2006-03-15; AN: A08-0790; Height: 5,09999990463257; MPN: SKRAAKE010; FootprintStatus: 'Active (Verified)'
TP301 = A08-0004: Single SMD testpad; PartGroup: Mechanical devices,Connectors,Test points; ComponentStatus: 'Active (verified)'; Status: Active; Verified by: Sveinung Helgeland; Verified date: 2006-02-17; AN: A08-0004; Value: TESTPAD; Height: 0; FootprintStatus: 'Active (Verified)'
TP302-TP306 = A09-0290: Hole for user grid with 1.27 mm pitch, 1x1 mm pad; PartGroup: Mechanical devices,PCB implemented components,PCB Screw Hole components; Value: Hole 0.65 mm; ComponentStatus: 'Active (verified)'; Status: Active; Verified by: Sveinung Helgeland; Verified date: 2006-02-17; AN: A09-0290; FootprintStatus: 'Active (Verified)'
U300 = A06-1392: Atmel 32-bit ARM Cortex-M0+ processor 100pin 256KB Flash 32KB SRAM 48MHz freq; PartGroup: Integrated Circuits,MCU, MPU, DSP,ARM MCU; ComponentStatus: 'Active (verified)'; AN: A06-1392; Height: 1.60000002384186; Manufacturer: ATMEL; MPN: ATSAM C21N18A-ANT; FootprintStatus: 'Active (Verified)'
XC300 = A07-0129: Kyocera ST3215SB32768E0HPWBB, 32.768kHz, 9pF, SMD tuning fork crystal; PartGroup: Frequency devices,Crystals,SMD; Manufacturer: Kyocera Crystal Device Corporation; Tolerance: Â±20ppm; TemperatureRange: -40Â°C to +85Â°C; ComponentStatus: 'Active (verified)'; Status: Active; Verified by: Sveinung Helgeland; Verified date: 2006-02-17; AN: A07-0129; Height: 0.800000011920929; MPN: ST3215SB32768E0HPWBB; FootprintStatus: 'Active (Verified)'
XC301 = A07-0078: 16MHz uXtal, 3.2 x 2.5 mm SMD, CL=9pF, 15PPM, ESR=80ohm(Max.; PartGroup: Frequency devices,Crystals,SMD; Manufacturer: Epson Toyocom; MPN: TSX-3225 16.0000MF09Z-AC3; TemperatureRange: -40Â°C to +85Â°C; ComponentStatus: 'Active (verified)'; AN: A07-0078; Tolerance: 15ppm; Height: 0.699999988079071; FootprintStatus: 'Active (Verified)'

## Sheet SAMC21N_Xplained_Pro_EDBG.SchDoc: Embedded Debugger (EDBG)
size A3; Organization: Microchip India; DocumentNumber: A09-2682; Revision: 4; SheetNumber: 5; SheetTotal: 9; CheckedBy: M.S.K; DrawnBy: Microchip India; PageSetup: Record=PageOptions|CenterHorizontal=True|CenterVertical=True|PrintScale=0.71|XCorrection=1.00|YCorrection=1.00|PrintKind=0|BorderSize=5000000|LeftOffset=0|BottomOffset=0|Orientation=2|PaperLength=1000|PaperWidth=1000|Scale=100|PaperSource=15|PrintQuality=600|MediaType=1|DitherType=10|PrintScaleMode=1|PaperKind=A4 (210 x 297 mm)|PaperIndex=9; ProjectTitle: ATSAMC21N-XPRO; PCBNumber: A08-2581; PCBRevision: 2
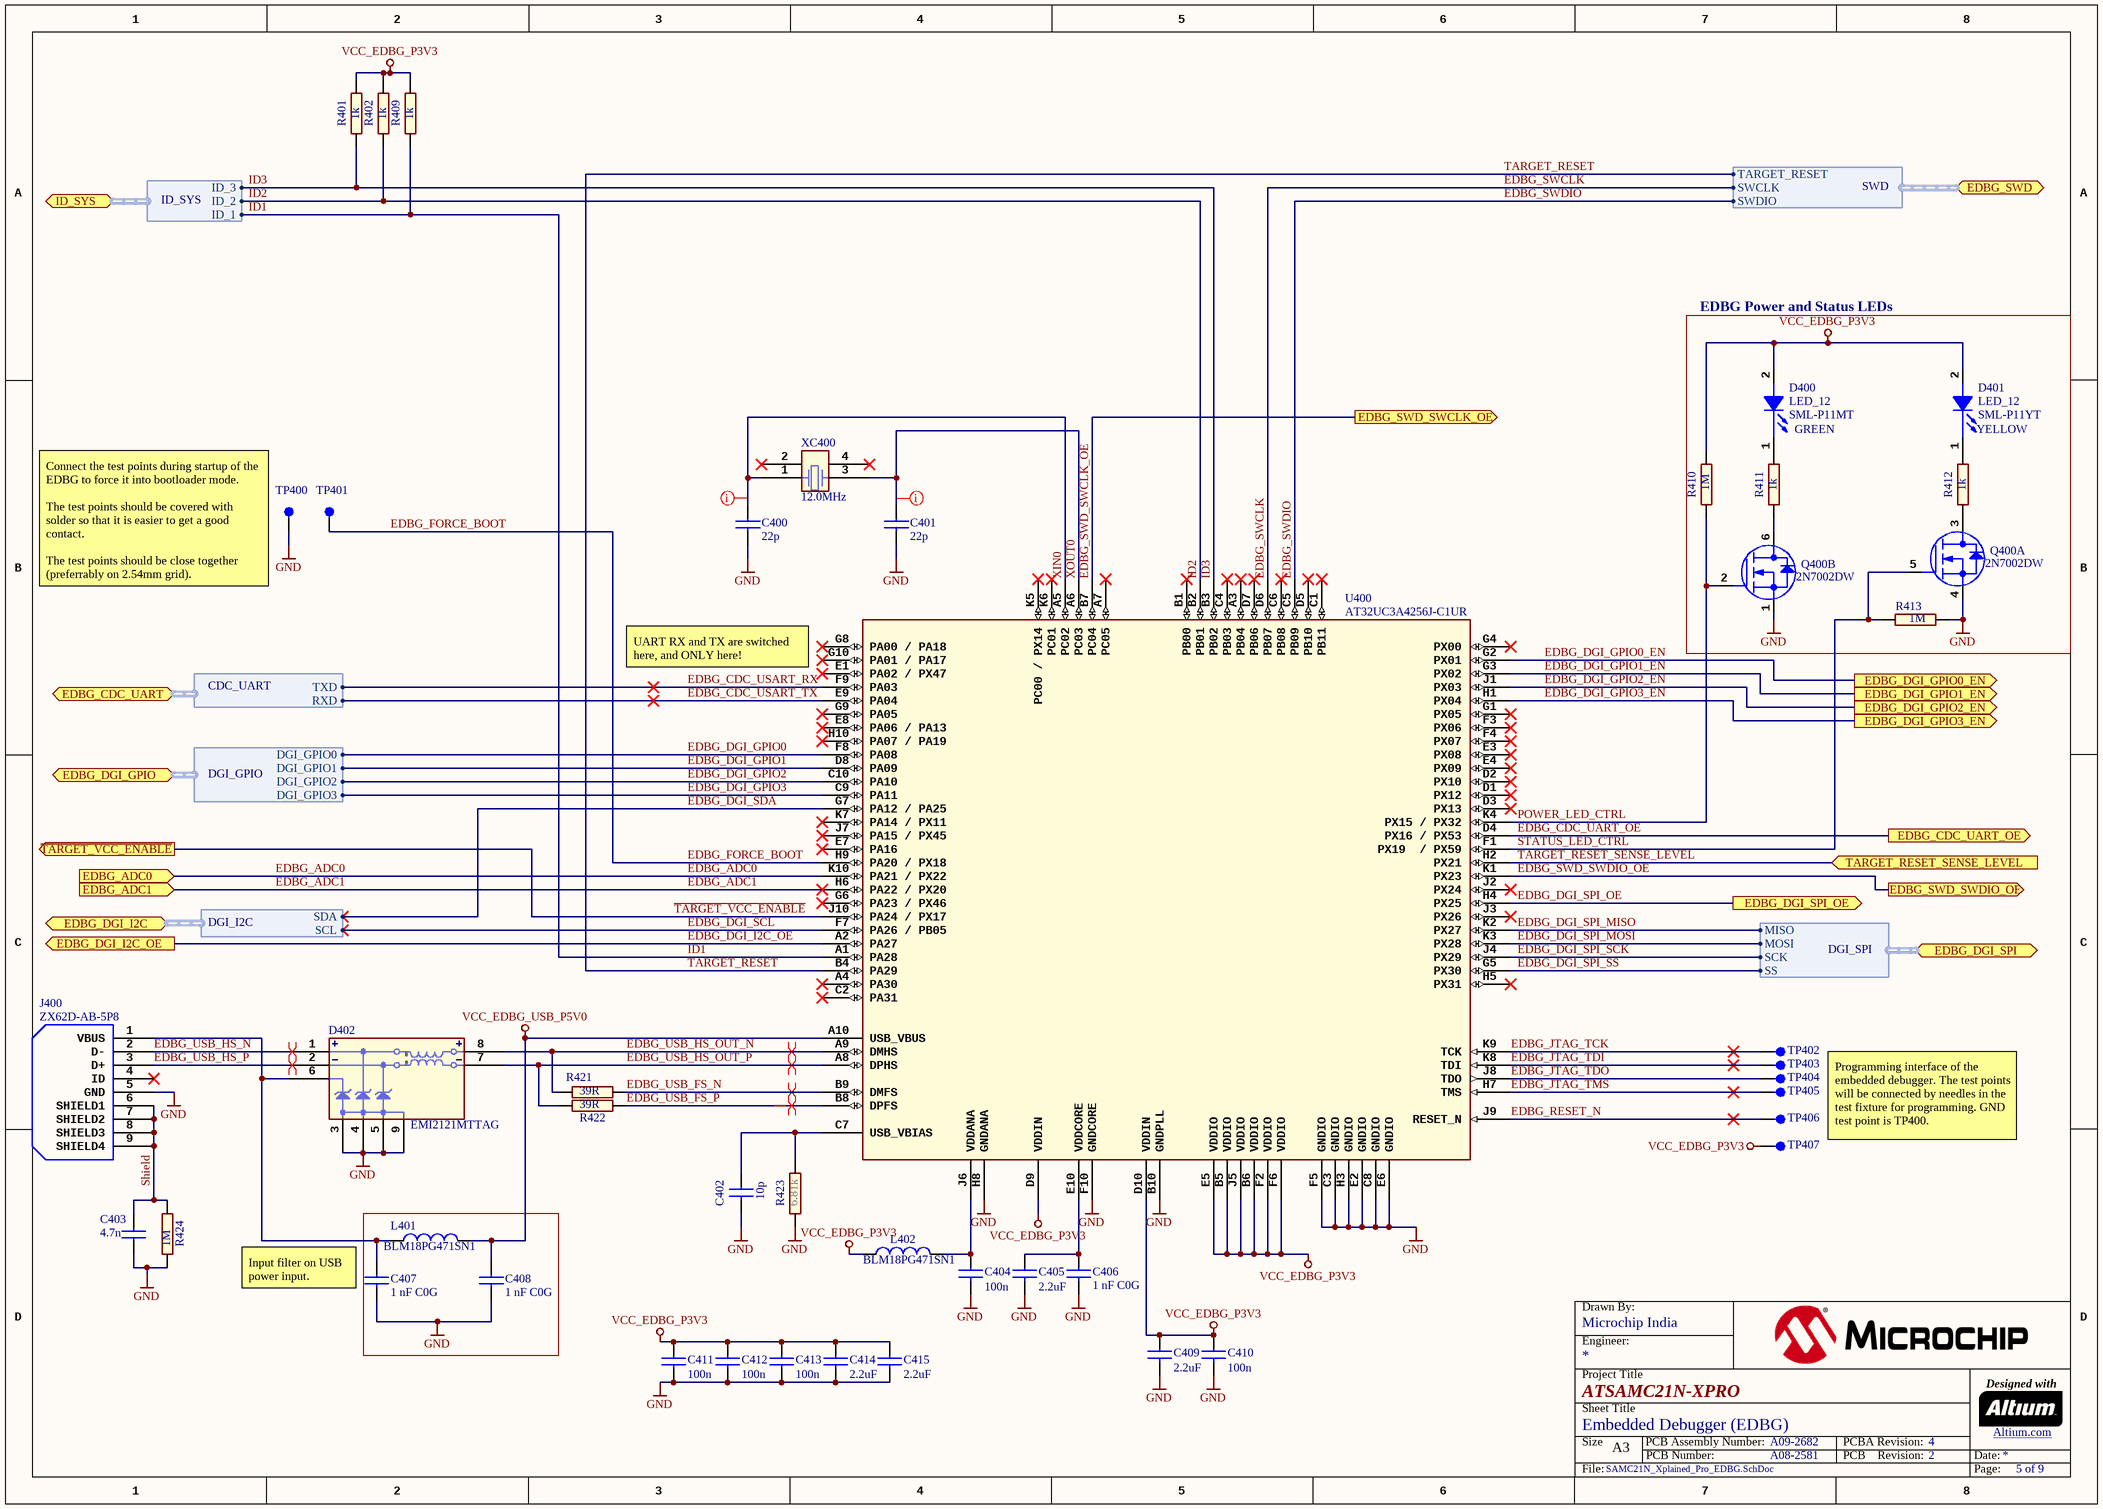
[diagram p2: SAMC21N_Xplained_Pro_EDBG.SchDoc]

### Parts
C400  22p  [AP1-00053]
C401  22p  [AP1-00053]
C402  10p  [AP1-00053]
C403  value 4.7n  [AP1-00053]  (hidden comment: CAP-NONPOL)
C404  100n  [AP1-00053]
C405  value 2.2uF  [AP1-00053]  (hidden comment: Farnell no: 1288200)
C406  1 nF C0G  [AP1-00053]
C407  1 nF C0G  [AP1-00053]
C408  1 nF C0G  [AP1-00053]
C409  value 2.2uF  [AP1-00053]  (hidden comment: Farnell no: 1288200)
C410  100n  [AP1-00053]
C411  100n  [AP1-00053]
C412  100n  [AP1-00053]
C413  100n  [AP1-00053]
C414  value 2.2uF  [AP1-00053]  (hidden comment: Farnell no: 1288200)
C415  value 2.2uF  [AP1-00053]  (hidden comment: Farnell no: 1288200)
D400  LED_12  value SML-P11MT  [AP4-00160]
D401  LED_12  value SML-P11YT  [AP4-00160]
D402  value EMI2121MTTAG  [AP4-00159]  (hidden comment: WDFN8)
J400  value ZX62D-AB-5P8  [AP8-00852]  (hidden comment: 2,000 pieces per reel)
L401  BLM18PG471SN1  [AP3-00005]
L402  BLM18PG471SN1  [AP3-00005]
Q400  value 2N7002DW  [AP5-00001]  (hidden comment: Same as 2N7002 but with two MOSFETs in one package)  (parts A,B of 2)
R401  value 1k  [AP2-00000]  (hidden comment: R2)
R402  value 1k  [AP2-00000]  (hidden comment: R2)
R409  value 1k  [AP2-00000]  (hidden comment: R2)
R410  value 1M  [AP2-00000]  (hidden comment: R2)
R411  value 1k  [AP2-00000]  (hidden comment: R2)
R412  value 1k  [AP2-00000]  (hidden comment: R2)
R413  value 1M  [AP2-00000]  (hidden comment: R2)
R421  value 39R  [AP2-00011]  (hidden comment: R2)
R422  value 39R  [AP2-00011]  (hidden comment: R2)
R423  value 6.81k  [AP2-00011]  (hidden comment: R2)
R424  value 1M  [AP2-00011]  (hidden comment: R2)
TP400  TESTPAD  [AP8-00010]  (value not drawn)  (no BOM)
TP401  TESTPAD  [AP8-00010]  (value not drawn)  (no BOM)
TP402  TESTPAD  [AP8-00010]  (value not drawn)  (no BOM)
TP403  TESTPAD  [AP8-00010]  (value not drawn)  (no BOM)
TP404  TESTPAD  [AP8-00010]  (value not drawn)  (no BOM)
TP405  TESTPAD  [AP8-00010]  (value not drawn)  (no BOM)
TP406  TESTPAD  [AP8-00010]  (value not drawn)  (no BOM)
TP407  TESTPAD  [AP8-00010]  (value not drawn)  (no BOM)
U400  value AT32UC3A4256J-C1UR  [AP6-00206]  (hidden comment: 100 ball VFBGA)
XC400  12.0MHz  [AP7-00039]

### Blocks framed on the sheet
EDBG Power and Status LEDs: D400 D401 Q400 R410-R413

### Ports
EDBG_ADC0 (in), EDBG_ADC1 (in), EDBG_CDC_UART (harness CDC_UART), EDBG_CDC_UART_OE (out), EDBG_DGI_GPIO0_EN (out), EDBG_DGI_GPIO1_EN (out), EDBG_DGI_GPIO2_EN (out), EDBG_DGI_GPIO3_EN (out), EDBG_DGI_GPIO (harness DGI_GPIO), EDBG_DGI_I2C (harness DGI_I2C), EDBG_DGI_I2C_OE (out), EDBG_DGI_SPI (harness DGI_SPI), EDBG_DGI_SPI_OE (out), EDBG_SWD (harness SWD), EDBG_SWD_SWCLK_OE (out), EDBG_SWD_SWDIO_OE (out), ID_SYS (harness ID_SYS), TARGET_RESET_SENSE_LEVEL (in), ~{TARGET_VCC_ENABLE} (out)

### Harnesses
CDC_UART: TXD, RXD
DGI_SPI: MISO, MOSI, SCK, SS
DGI_GPIO: DGI_GPIO0, DGI_GPIO1, DGI_GPIO2, DGI_GPIO3
ID_SYS: ID_1, ID_2, ID_3
SWD: SWCLK, SWDIO, TARGET_RESET
DGI_I2C: SCL, SDA

### Nets
GND: C400.2 C401.2 C402.2 C403.1 C404.2 C405.2 C406.2 C407.2 C408.2 C409.2 C410.2 C411.2 C412.2 C413.2 C414.2 C415.2 D402.3(GND) D402.4(GND) D402.5(GND) D402.9(GND) J400.5(GND) Q400.1(S2) Q400.4(S1) R413.1 R423.1 R424.1 TP400.1 U400.B10(GNDPLL) U400.C3(GNDIO) U400.C8(GNDIO) U400.E2(GNDIO) U400.E6(GNDIO) U400.F5(GNDIO) U400.F10(GNDCORE) U400.H3(GNDIO) U400.H8(GNDANA)
VCC_EDBG_P3V3: C409.1 C410.1 C411.1 C412.1 C413.1 C414.1 C415.1 D400.2(ANODE) D401.2(ANODE) L402.1 R401.2 R402.2 R409.2 R410.2 TP407.1 U400.B5(VDDIO) U400.B6(VDDIO) U400.D9(VDDIN) U400.D10(VDDIN) U400.E5(VDDIO) U400.F2(VDDIO) U400.F6(VDDIO) U400.J5(VDDIO)
VCC_EDBG_USB_P5V0: C408.1 L401.2 U400.A10(USB_VBUS)
EDBG_ADC0: U400.K10(PA21_/_PX22) ; port EDBG_ADC0
EDBG_ADC1: U400.H6(PA22_/_PX20) ; port EDBG_ADC1
EDBG_CDC_UART_OE: U400.D4(PX16_/_PX53) ; port EDBG_CDC_UART_OE
EDBG_CDC_USART_RX: U400.F9(PA03) ; port EDBG_CDC_UART.TXD  [project net EDBG_CDC_UART_TX]
EDBG_CDC_USART_TX: U400.E9(PA04) ; port EDBG_CDC_UART.RXD  [project net EDBG_CDC_UART_RX]
EDBG_DGI_GPIO0: U400.F8(PA08) ; port EDBG_DGI_GPIO.DGI_GPIO0
EDBG_DGI_GPIO0_EN: U400.G2(PX01) ; port EDBG_DGI_GPIO0_EN
EDBG_DGI_GPIO1: U400.D8(PA09) ; port EDBG_DGI_GPIO.DGI_GPIO1
EDBG_DGI_GPIO1_EN: U400.G3(PX02) ; port EDBG_DGI_GPIO1_EN
EDBG_DGI_GPIO2: U400.C10(PA10) ; port EDBG_DGI_GPIO.DGI_GPIO2
EDBG_DGI_GPIO2_EN: U400.J1(PX03) ; port EDBG_DGI_GPIO2_EN
EDBG_DGI_GPIO3: U400.C9(PA11) ; port EDBG_DGI_GPIO.DGI_GPIO3
EDBG_DGI_GPIO3_EN: U400.H1(PX04) ; port EDBG_DGI_GPIO3_EN
EDBG_DGI_I2C_OE: U400.A2(PA27) ; port EDBG_DGI_I2C_OE
EDBG_DGI_SCL: U400.F7(PA26_/_PB05) ; port EDBG_DGI_I2C.SCL  [project net EDBG_DGI_I2C_SCL]
EDBG_DGI_SDA: U400.G7(PA12_/_PA25) ; port EDBG_DGI_I2C.SDA  [project net EDBG_DGI_I2C_SDA]
EDBG_DGI_SPI_MISO: U400.K2(PX27) ; port EDBG_DGI_SPI.MISO
EDBG_DGI_SPI_MOSI: U400.K3(PX28) ; port EDBG_DGI_SPI.MOSI
EDBG_DGI_SPI_OE: U400.H4(PX25) ; port EDBG_DGI_SPI_OE
EDBG_DGI_SPI_SCK: U400.J4(PX29) ; port EDBG_DGI_SPI.SCK
EDBG_DGI_SPI_SS: U400.G5(PX30) ; port EDBG_DGI_SPI.SS
EDBG_FORCE_BOOT: TP401.1 U400.H9(PA20_/_PX18)
EDBG_JTAG_TCK: TP402.1 U400.K9(TCK)
EDBG_JTAG_TDI: TP403.1 U400.K8(TDI)
EDBG_JTAG_TDO: TP404.1 U400.J8(TDO)
EDBG_JTAG_TMS: TP405.1 U400.H7(TMS)
EDBG_RESET_N: TP406.1 U400.J9(RESET_N)
EDBG_SWCLK: U400.D6(PB07) ; port EDBG_SWD.SWCLK
EDBG_SWD_SWCLK_OE: U400.B7(PC04) ; port EDBG_SWD_SWCLK_OE
EDBG_SWD_SWDIO_OE: U400.K1(PX23) ; port EDBG_SWD_SWDIO_OE
EDBG_SWDIO: U400.C5(PB09) ; port EDBG_SWD.SWDIO
EDBG_USB_FS_N: R421.2 U400.B9(DMFS)
EDBG_USB_FS_P: R422.2 U400.B8(DPFS)
EDBG_USB_HS_N: D402.1(DIFF1_EXT) J400.2(D-)
EDBG_USB_HS_OUT_N: D402.8(DIFF1_INT) R421.1 U400.A9(DMHS)
EDBG_USB_HS_OUT_P: D402.7(DIFF2_INT) R422.1 U400.A8(DPHS)
EDBG_USB_HS_P: D402.2(DIFF2_EXT) J400.3(D+)
ID1: R409.1 U400.A1(PA28) ; port ID_SYS.ID_1
ID2: R402.1 U400.B2(PB01) ; port ID_SYS.ID_2
ID3: R401.1 U400.B3(PB02) ; port ID_SYS.ID_3
POWER_LED_CTRL: Q400.2(G2) R410.1 U400.K4(PX15_/_PX32)
Shield: C403.2 J400.6(SHIELD1) J400.7(SHIELD2) J400.8(SHIELD3) J400.9(SHIELD4) R424.2
STATUS_LED_CTRL: Q400.5(G1) R413.2 U400.F1(PX19__/_PX59)
~{TARGET_VCC_ENABLE}: U400.J10(PA24_/_PX17) ; port ~{TARGET_VCC_ENABLE}
TARGET_RESET: U400.B4(PA29) ; port EDBG_SWD.TARGET_RESET
TARGET_RESET_SENSE_LEVEL: U400.H2(PX21) ; port TARGET_RESET_SENSE_LEVEL
XIN0: C400.1 U400.A5(PC02) XC400.1
XOUT0: C401.1 U400.A6(PC03) XC400.3
NetC402_1: C402.1 R423.2 U400.C7(USB_VBIAS)
NetC404_1: C404.1 L402.2 U400.J6(VDDANA)
NetC405_1: C405.1 C406.1 U400.E10(VDDCORE)
NetC407_1: C407.1 D402.6(VBUS) J400.1(VBUS) L401.1
NetD400_1: D400.1(CATHODE) R411.2
NetD401_1: D401.1(CATHODE) R412.2
NetQ400_3: Q400.3(D1) R412.1
NetQ400_6: Q400.6(D2) R411.1

Not connected (* = marked no-connect by the designer): J400 4(ID)*; U400 A3(PB04)* A4(PA30)* A7(PC05)* B1(PB00)* C1(PB11)* C2(PA31)* C4(PB03)* C6(PB08)* D1(PX12)* D2(PX10)* D3(PX13)* D5(PB10)* D7(PB06)* E1(PA02_/_PX47)* E3(PX08)* E4(PX09)* E7(PA16)* E8(PA06_/_PA13)* F3(PX06)* F4(PX07)* G1(PX05)* G4(PX00)* G6(PA23_/_PX46)* G8(PA00_/_PA18)* G9(PA05)* G10(PA01_/_PA17)* H5(PX31)* H10(PA07_/_PA19)* J2(PX24)* J3(PX26)* J7(PA15_/_PX45)* K5(PC00_/_PX14)* K6(PC01)* K7(PA14_/_PX11)*; XC400 2* 4*

### Layout directives
differential pair; rule Assembly Testpoint Usage [Testpoint - Not Allowed    Multiple - Not Allowed]: EDBG_USB_FS_N, EDBG_USB_FS_P, EDBG_USB_HS_N, EDBG_USB_HS_OUT_N, EDBG_USB_HS_OUT_P, EDBG_USB_HS_P
rule Assembly Testpoint Usage [Testpoint - Not Allowed    Multiple - Not Allowed]: XIN0, XOUT0

### Notes on the sheet
- GREEN
- (near D401) YELLOW
- (near TP400) Connect the test points during startup of the EDBG to force it into bootloader mode.
  The test points should be covered with solder so that it is easier to get a good contact.
  The test points should be close together (preferrably on 2.54mm grid).
- UART RX and TX are switched here, and ONLY here!
- Programming interface of the embedded debugger. The test points will be connected by needles in the test fixture for programming. GND test point is TP400.
- (near C407) Input filter on USB power input.
- Drawn By:
- Project Title
- Engineer:
- Designed with
- Sheet Title
- Size
- A3
- PCB Number:
- PCB Assembly Number:
- PCBA Revision:
- PCB    Revision:
- Date:
- Altium.com <http://go.altium.com/MicrochipLandingPage_Evaluation.html>
- File:
- Page:

### Library data of the parts
C400 C401 = A01-0019: Ceramic capacitor, SMD 0402, NP0, 50V, +/-5%; PartGroup: Capacitors,Ceramic,SMD 0402; TemperatureRange: -55 - +125 deg C; ComponentStatus: 'Active (verified)'; Status: Active; Verified by: Lars Helge Mo; Verified date: 2005-12-15; AN: A01-0019; Value: 22p; Tolerance: 50V, +/-5%; Height: 0,550000011920929; FootprintStatus: 'Active (Verified)'
C402 = A01-0015: as C318 on sheet SAMC21N_Xplained_Pro_Target_MCU; Status: Active; Verified by: Lars Helge Mo; Verified date: 2005-12-15; AN: A01-0015; Value: 10p; Tolerance: 50V, +/-5%; Height: 0,550000011920929; FootprintStatus: 'Active (Verified)'
C403 = A01-0046: Ceramic capacitor, SMD 0402, X7R, 25V, +/-10%; PartGroup: Capacitors,Ceramic,SMD 0402; TemperatureRange: -55 - +125 deg C; ComponentStatus: 'Active (verified)'; Status: Active; Verified by: Lars Helge Mo; Verified date: 2005-12-15; AN: A01-0046; Tolerance: 25V, +/-10%; Height: 0.550000011920929; FootprintStatus: 'Active (Verified)'
C404 C410-C413 = A01-0246: as C304 on sheet SAMC21N_Xplained_Pro_Target_MCU; Status: Active; Verified by: Lars Helge Mo; Verified date: 2005-12-15; AN: A01-0246; Value: 100n; Tolerance: 16V, +/-10%; Height: 0,5; FootprintStatus: 'Active (Verified)'
C405 C409 C414 C415 = A01-0300: Ceramic capacitor, SMD 0402, X5R, 6.3V, +/-20%; PartGroup: Capacitors,Ceramic,SMD 0402; Manufacturer: Kemet; MPN: C0402C225M9PAC; Tolerance: ±20%; TemperatureRange: -55°C to +85°C; ComponentStatus: 'Active (verified)'; Status: Active; Verified by: Lars Helge Mo; Verified date: 2005-12-15; AN: A01-0300; Height: 0,5; FootprintStatus: 'Active (Verified)'
C406-C408 = A01-0321: Ceramic capacitor, SMD 0402, C0G, 50V, +/-5%; PartGroup: Capacitors,Ceramic,SMD 0402; Manufacturer: Murata; MPN: GRM1555C1H102JA01D; Tolerance: 5%; ComponentStatus: 'Active (verified)'; Status: Active; Verified by: Lars Helge Mo; Verified date: 2005-12-15; AN: A01-0321; Value: 1 nF C0G; FootprintStatus: 'Active (Verified)'
D400 = A10-0183: LED, SMD 0402, Green, Wave length=569nm, 2.1mcd @ (1mA, 1.9Vf); PartGroup: Opto,LEDs,SMD; Manufacturer: ROHM; MPN: SML-P11MT-T86; TemperatureRange: -40 to +85; ComponentStatus: 'Active (verified)'; Verified date: 2006-02-17; Verified by: Sveinung Helgeland; Status: Active; AN: A10-0183; Height: 0.200000002980232; FootprintStatus: 'Active (Verified)'
D401 = A10-0182: LED, SMD 0402, Yellow, Wave length=586nm, 7.6mcd @ (1mA, 1.9Vf); PartGroup: Opto,LEDs,SMD; Manufacturer: ROHM; MPN: SML-P11YT-T86; TemperatureRange: -40 to +85; ComponentStatus: 'Active (verified)'; Verified date: 2006-02-17; Verified by: Sveinung Helgeland; Status: Active; AN: A10-0182; Height: 0.200000002980232; FootprintStatus: 'Active (Verified)'
D402 = A04-0195: EMI2121, SZEMI2121 Single Pair Common Mode Filter with ESD Protection; PartGroup: Diodes,Transient suppression; Manufacturer: ON Semiconductor; TemperatureRange: âˆ’40 to +85 Â°C; ComponentStatus: 'Active (verified)'; AN: A04-0195; Height: 0.800000011920929; MPN: EMI2121MTTAG; FootprintStatus: 'Active (Verified)'
J400 = A08-2112: Micro USB AB Connector, Standard SMT + DIP; PartGroup: Mechanical devices,Connectors,USB; ComponentStatus: 'Active (verified)'; Verified date: 2006-05-18; Verified by: Eirik Rasmussen; Status: Active; AN: A08-2112; Height: 2.79999995231628; FootprintStatus: 'New (Not verified)'
L401 L402 = A03-0035: as L300 on sheet SAMC21N_Xplained_Pro_Target_MCU; Verified date: 2006-01-30; Verified by: Lars Helge Mo; Status: Active; AN: A03-0035; Value: BLM18PG471SN1; Height: 0,800000011920929; MPN: BLM18PG471SN1; FootprintStatus: 'Active (Verified)'
Q400 = A05-0051: Dual N-Channel MOSFET, 60V, 115mA cont,RDS(ON) < 7.5 Ohm @50mA@5V, SOT-363; PartGroup: Transistors,Small signal FET,SMD; Manufacturer: Fairchild; TemperatureRange: -65 to 150 deg C; ComponentStatus: 'Active (verified)'; Status: New; AN: A05-0051; Height: 1,10000002384186; MPN: 2N7002DW; FootprintStatus: 'Active (Verified)'
R401 R402 R409 = A02-0212: as R301 on sheet SAMC21N_Xplained_Pro_Target_MCU; Status: Active; Verified by: Lars Helge Mo; Verified date: 2005-12-19; AN: A02-0212; Tolerance: 1 %; Height: 0.349999994039536; FootprintStatus: 'Active (Verified)'
R410 R413 R424 = A02-0284: Thick film resistor, SMD 0402, 1/16W, 1%; PartGroup: Resistors,SMD,0402 1%; Manufacturer: KOA; MPN: RK73H1ETTP1004F; TemperatureRange: -55 - +125 deg C; ComponentStatus: 'Active (verified)'; Status: Active; Verified by: Lars Helge Mo; Verified date: 2005-12-19; AN: A02-0284; Tolerance: 1 %; FootprintStatus: 'Active (Verified)'
  R410 R413: Height: 0.349999994039536
  R424: Height: 0,349999994039536
R411 R412 = A02-0212: Thick film resistor, SMD 0402, 1/16W, 1%; PartGroup: Resistors,SMD,0402 1%; Manufacturer: ASJ; MPN: CR10-1001-FK; TemperatureRange: -55 - +125 deg C; ComponentStatus: 'Active (verified)'; Status: Active; Verified by: Lars Helge Mo; Verified date: 2005-12-19; AN: A02-0212; Tolerance: 1 %; Height: 0.349999994039536; FootprintStatus: 'Active (Verified)'
R421 R422 = A02-0178: as R304 on sheet SAMC21N_Xplained_Pro_Target_MCU; Status: Active; Verified by: Lars Helge Mo; Verified date: 2005-12-19; AN: A02-0178; Tolerance: 1 %; Height: 0,349999994039536; FootprintStatus: 'Active (Verified)'
R423 = A02-0539: Thick film resistor, SMD 0402, 1/16W, 1%; PartGroup: Resistors,SMD,0402 1%; TemperatureRange: -55 - +125 deg C; ComponentStatus: 'Active (verified)'; Status: Active; Verified by: Lars Helge Mo; Verified date: 2005-12-19; AN: A02-0539; Tolerance: 1%; Height: 0,349999994039536; FootprintStatus: 'Active (Verified)'
TP400-TP407 = A08-0004: as TP301 on sheet SAMC21N_Xplained_Pro_Target_MCU; Status: Active; Verified by: Sveinung Helgeland; Verified date: 2006-02-17; AN: A08-0004; Value: TESTPAD; Height: 0; FootprintStatus: 'Active (Verified)'
U400 = A06-0736: AVR 32-bit RISC MCU; PartGroup: Integrated Circuits,MCU, MPU, DSP,AVR MCU; Manufacturer: ATMEL; TemperatureRange: -40 to +85 deg C; ComponentStatus: 'Active (verified)'; Status: Not verified; AN: A06-0736; Height: 1; MPN: AT32UC3A4256J-C1UR; FootprintStatus: 'Active (Verified)'
XC400 = A07-0042: Fox FQ5032B 12.0MHz SMD crystal 738B-12; PartGroup: Frequency devices,Crystals,SMD; Manufacturer: Fox  Electronics; MPN: FQ5032B-12-C-C-C-200-1; Tolerance: 30PPM; ComponentStatus: 'Active (verified)'; Status: Active; Verified by: Ketil Skjerve; Verified date: 2007-06-15; AN: A07-0042; Value: 12.0MHz; Height: 1,20000004768372; FootprintStatus: 'Active (Verified)'

## Sheet SAMC21N_Xplained_Pro_Connectors.SchDoc: Extension connectors
size A3; Organization: Microchip India; DocumentNumber: A09-2682; Revision: 4; SheetNumber: 3; SheetTotal: 9; CheckedBy: M.S.K; DrawnBy: Microchip India; PageSetup: Record=PageOptions|CenterHorizontal=True|CenterVertical=True|PrintScale=1.01|XCorrection=1.00|YCorrection=1.00|PrintKind=1|BorderSize=5000000|LeftOffset=0|BottomOffset=0|Orientation=2|PaperLength=1000|PaperWidth=1000|Scale=100|PaperSource=7|PrintQuality=-4|MediaType=1|DitherType=10|PaperKind=A3 (297 x 420 mm)|PrintScaleMode=1; PCBNumber: A08-2581; PCBRevision: 2; ProjectTitle: ATSAMC21N-XPRO
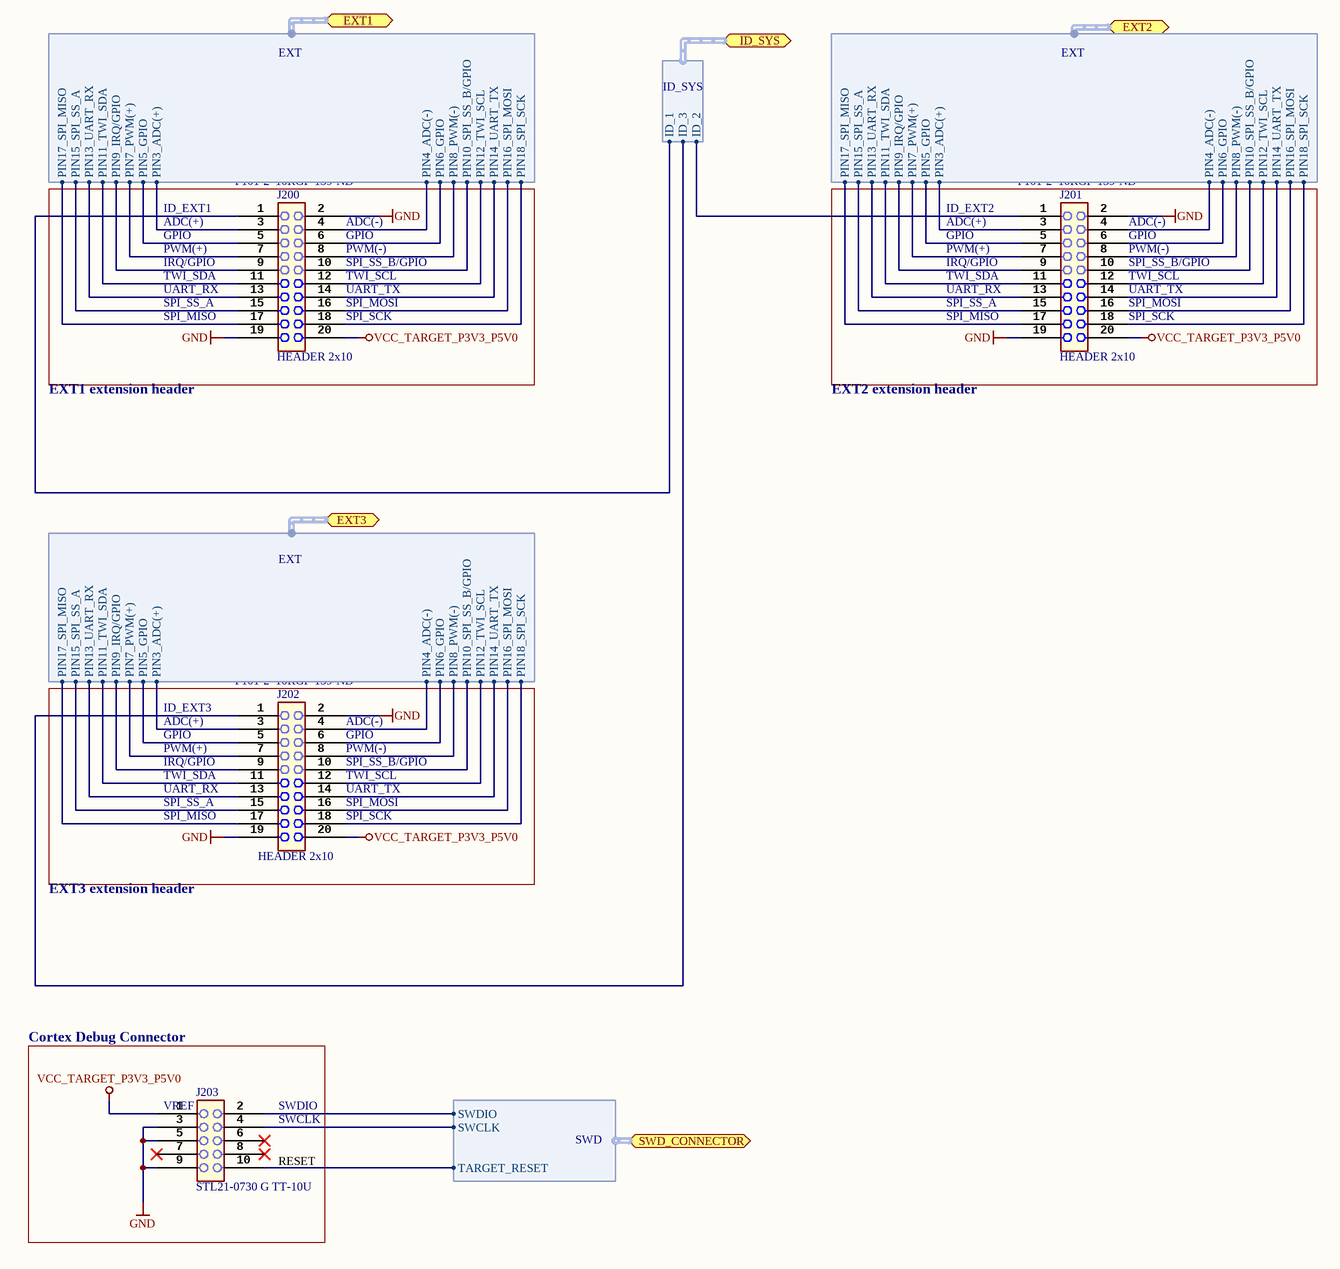
[diagram p3: SAMC21N_Xplained_Pro_Connectors.SchDoc]

### Parts
J200  HEADER 2x10  value P101-2*10RGF-139-ND  [AP8-00622]
J201  HEADER 2x10  value P101-2*10RGF-139-ND  [AP8-00622]
J202  HEADER 2x10  value P101-2*10RGF-139-ND  [AP8-00622]
J203  MPN: STL21-0730 G TT-10U  [AP8-00257]  (hidden comment: HEADER 2x5)

### Blocks framed on the sheet
Cortex Debug Connector: J203

### Ports
EXT1 (harness EXT), EXT2 (harness EXT), EXT3 (harness EXT), ID_SYS (harness ID_SYS), SWD_CONNECTOR (harness SWD)

### Harnesses
ID_SYS: ID_1, ID_2, ID_3
EXT: PIN3_ADC(+), PIN4_ADC(-), PIN5_GPIO, PIN6_GPIO, PIN7_PWM(+), PIN8_PWM(-), PIN9_IRQ/GPIO, PIN10_SPI_SS_B/GPIO, PIN11_TWI_SDA, PIN12_TWI_SCL, PIN13_UART_RX, PIN14_UART_TX, PIN15_SPI_SS_A, PIN16_SPI_MOSI, PIN17_SPI_MISO, PIN18_SPI_SCK
SWD: SWCLK, SWDIO, TARGET_RESET

### Nets
GND: J200.2 J200.19 J201.2 J201.19 J202.2 J202.19 J203.3 J203.5 J203.9
VCC_TARGET_P3V3_P5V0: J200.20 J201.20 J202.20 J203.1
ID1: J200.1 ; port ID_SYS.ID_1
ID2: J201.1 ; port ID_SYS.ID_2
ID3: J202.1 ; port ID_SYS.ID_3
PA08_AIN10_X0: J201.3 ; port EXT2.PIN3_ADC(+)
PA09_AIN11_X1: J201.4 ; port EXT2.PIN4_ADC(-)
PA10_S2_RTS_TE_Y18: J200.5 ; port EXT1.PIN5_GPIO
PA11_S2_CTS_Y19: J200.6 ; port EXT1.PIN6_GPIO
PA12_S2_UART_TX: J200.14 ; port EXT1.PIN14_UART_TX
PA13_S2_UART_RX: J200.13 ; port EXT1.PIN13_UART_RX
PA16_S1_I2C_SDA: J201.11 J202.11 ; port EXT3.PIN11_TWI_SDA, port EXT2.PIN11_TWI_SDA
PA17_S1_I2C_SCL: J201.12 J202.12 ; port EXT3.PIN12_TWI_SCL, port EXT2.PIN12_TWI_SCL
PA18_S1_SPI_MOSI_Y22: J200.16 ; port EXT1.PIN16_SPI_MOSI
PA19_S1_SPI_SCK_Y23: J200.18 ; port EXT1.PIN18_SPI_SCK
PA20_S3_RTS_TE_X8: J201.5 ; port EXT2.PIN5_GPIO
PA21_S3_CTS_X9: J201.6 ; port EXT2.PIN6_GPIO
PA22_IRQ6_X10_Y26: J200.9 ; port EXT1.PIN9_IRQ/GPIO
PA23_GPIO_X11_Y27: J200.10 ; port EXT1.PIN10_SPI_SS_B/GPIO
PA27_GPIO_SS: J202.10 ; port EXT3.PIN10_SPI_SS_B/GPIO
PA28_GPIO_IRQ8: J202.9 ; port EXT3.PIN9_IRQ/GPIO
PA30_SWCLK: J203.4 ; port SWD_CONNECTOR.SWCLK
PA31_SWDIO: J203.2 ; port SWD_CONNECTOR.SWDIO
PB00_S5_SPI_MOSI: J201.16 ; port EXT2.PIN16_SPI_MOSI
PB01_S5_SPI_SCK: J201.18 ; port EXT2.PIN18_SPI_SCK
PB02_S5_SPI_MISO: J201.17 ; port EXT2.PIN17_SPI_MISO
PB03_S5_SPI_SS: J201.15 ; port EXT2.PIN15_SPI_SS_A
PB06_AIN8_INN2: J202.4 ; port EXT3.PIN4_ADC(-)
PB07_AIN9_INP2: J202.3 ; port EXT3.PIN3_ADC(+)
PB08_INN1_Y14: J200.4 ; port EXT1.PIN4_ADC(-)
PB09_INP1_Y15: J200.3 ; port EXT1.PIN3_ADC(+)
PB12_TC4_WO0_X12_Y28: J200.7 ; port EXT1.PIN7_PWM(+)
PB13_TC4_WO1_X13_Y29: J200.8 ; port EXT1.PIN8_PWM(-)
PB16_S5_I2C_SDA: J200.11 ; port EXT1.PIN11_TWI_SDA
PB17_S5_I2C_SCL: J200.12 ; port EXT1.PIN12_TWI_SCL
PB20_S3_UART_TX: J201.14 ; port EXT2.PIN14_UART_TX
PB21_S3_UART_RX: J201.13 ; port EXT2.PIN13_UART_RX
PB22_TCC1_WO2: J202.7 ; port EXT3.PIN7_PWM(+)
PB23_TCC1_WO3: J202.8 ; port EXT3.PIN8_PWM(-)
PB30_PWM_TC0_WO0: J201.7 ; port EXT2.PIN7_PWM(+)
PB31_PWM_TC0_WO1: J201.8 ; port EXT2.PIN8_PWM(-)
PC11_S7_SPI_SCK: J202.18 ; port EXT3.PIN18_SPI_SCK
PC12_S7_SPI_MISO: J202.17 ; port EXT3.PIN17_SPI_MISO
PC13_S7_SPI_SS: J202.15 ; port EXT3.PIN15_SPI_SS_A
PC14_S7_SPI_MOSI: J202.16 ; port EXT3.PIN16_SPI_MOSI
PC16_S6_UART_TX: J202.14 ; port EXT3.PIN14_UART_TX
PC17_S6_UART_RX: J202.13 ; port EXT3.PIN13_UART_RX
PC18_S6_RTS_TE: J202.5 ; port EXT3.PIN5_GPIO
PC19_S6_CTS: J202.6 ; port EXT3.PIN6_GPIO
PC24_GPIO_IRQ0: J201.9 ; port EXT2.PIN9_IRQ/GPIO
PC25_GPIO: J201.10 ; port EXT2.PIN10_SPI_SS_B/GPIO
PC27_S1_SPI_MISO: J200.17 ; port EXT1.PIN17_SPI_MISO
PC28_S1_SPI_SS: J200.15 ; port EXT1.PIN15_SPI_SS_A
TARGET_RESET_CON: J203.10 ; port SWD_CONNECTOR.TARGET_RESET

Not connected (* = marked no-connect by the designer): J203 6* 7* 8*

### Notes on the sheet
- ID_EXT1
- ADC(+)
- GPIO
- PWM(+)
- IRQ/GPIO
- (near J200) ADC(-)
- (near J200) GPIO
- (near J200) PWM(-)
- (near J200) SPI_SS_B/GPIO
- ID_EXT2
- (near J201) ADC(-)
- (near J201) GPIO
- (near J201) PWM(-)
- (near J201) SPI_SS_B/GPIO
- TWI_SDA
- UART_RX
- SPI_SS_A
- SPI_MISO
- (near J200) TWI_SCL
- (near J200) UART_TX
- (near J200) SPI_MOSI
- (near J200) SPI_SCK
- (near J201) TWI_SCL
- (near J201) UART_TX
- (near J201) SPI_MOSI
- (near J201) SPI_SCK
- EXT1 extension header
- EXT2 extension header
- ID_EXT3
- (near J202) ADC(-)
- (near J202) GPIO
- (near J202) PWM(-)
- (near J202) SPI_SS_B/GPIO
- (near J202) TWI_SCL
- (near J202) UART_TX
- (near J202) SPI_MOSI
- (near J202) SPI_SCK
- EXT3 extension header
- (near J203) VREF
- SWDIO
- SWCLK
- RESET
- Drawn By:
- Project Title
- Engineer:
- Designed with
- Sheet Title
- Size
- A3
- PCB Number:
- PCB Assembly Number:
- PCBA Revision:
- PCB    Revision:
- Date:
- Altium.com <http://go.altium.com/MicrochipLandingPage_Evaluation.html>
- File:
- Page:

### Library data of the parts
J200-J202 = A08-1513: Pin header, 2x10, Right Angle, 2.54mm, THM, Pin In Paste; PartGroup: Mechanical devices,Connectors,Pin headers; ComponentStatus: 'New (not verified)'; Status: Active; Verified by: Lars Helge Mo; Verified date: 2005-12-19; AN: A08-1513; MPN: P101-2*10RGF-139-ND; FootprintStatus: 'Active (Verified)'
J203 = A08-0385: 2x5 pin header, 1.27mm pitch, THM; PartGroup: Mechanical devices,Connectors,Pin headers; Manufacturer: Garry; Value: PIN HEADER 2x5; ComponentStatus: 'Active (verified)'; Verified date: 2005-12-19; Verified by: Lars Helge Mo; Status: Active; AN: A08-0385; Height: 7.30000019073486; FootprintStatus: 'Active (Verified)'